# EAGLE board KickerBoard2.0 (EAGLE 9.2.0)
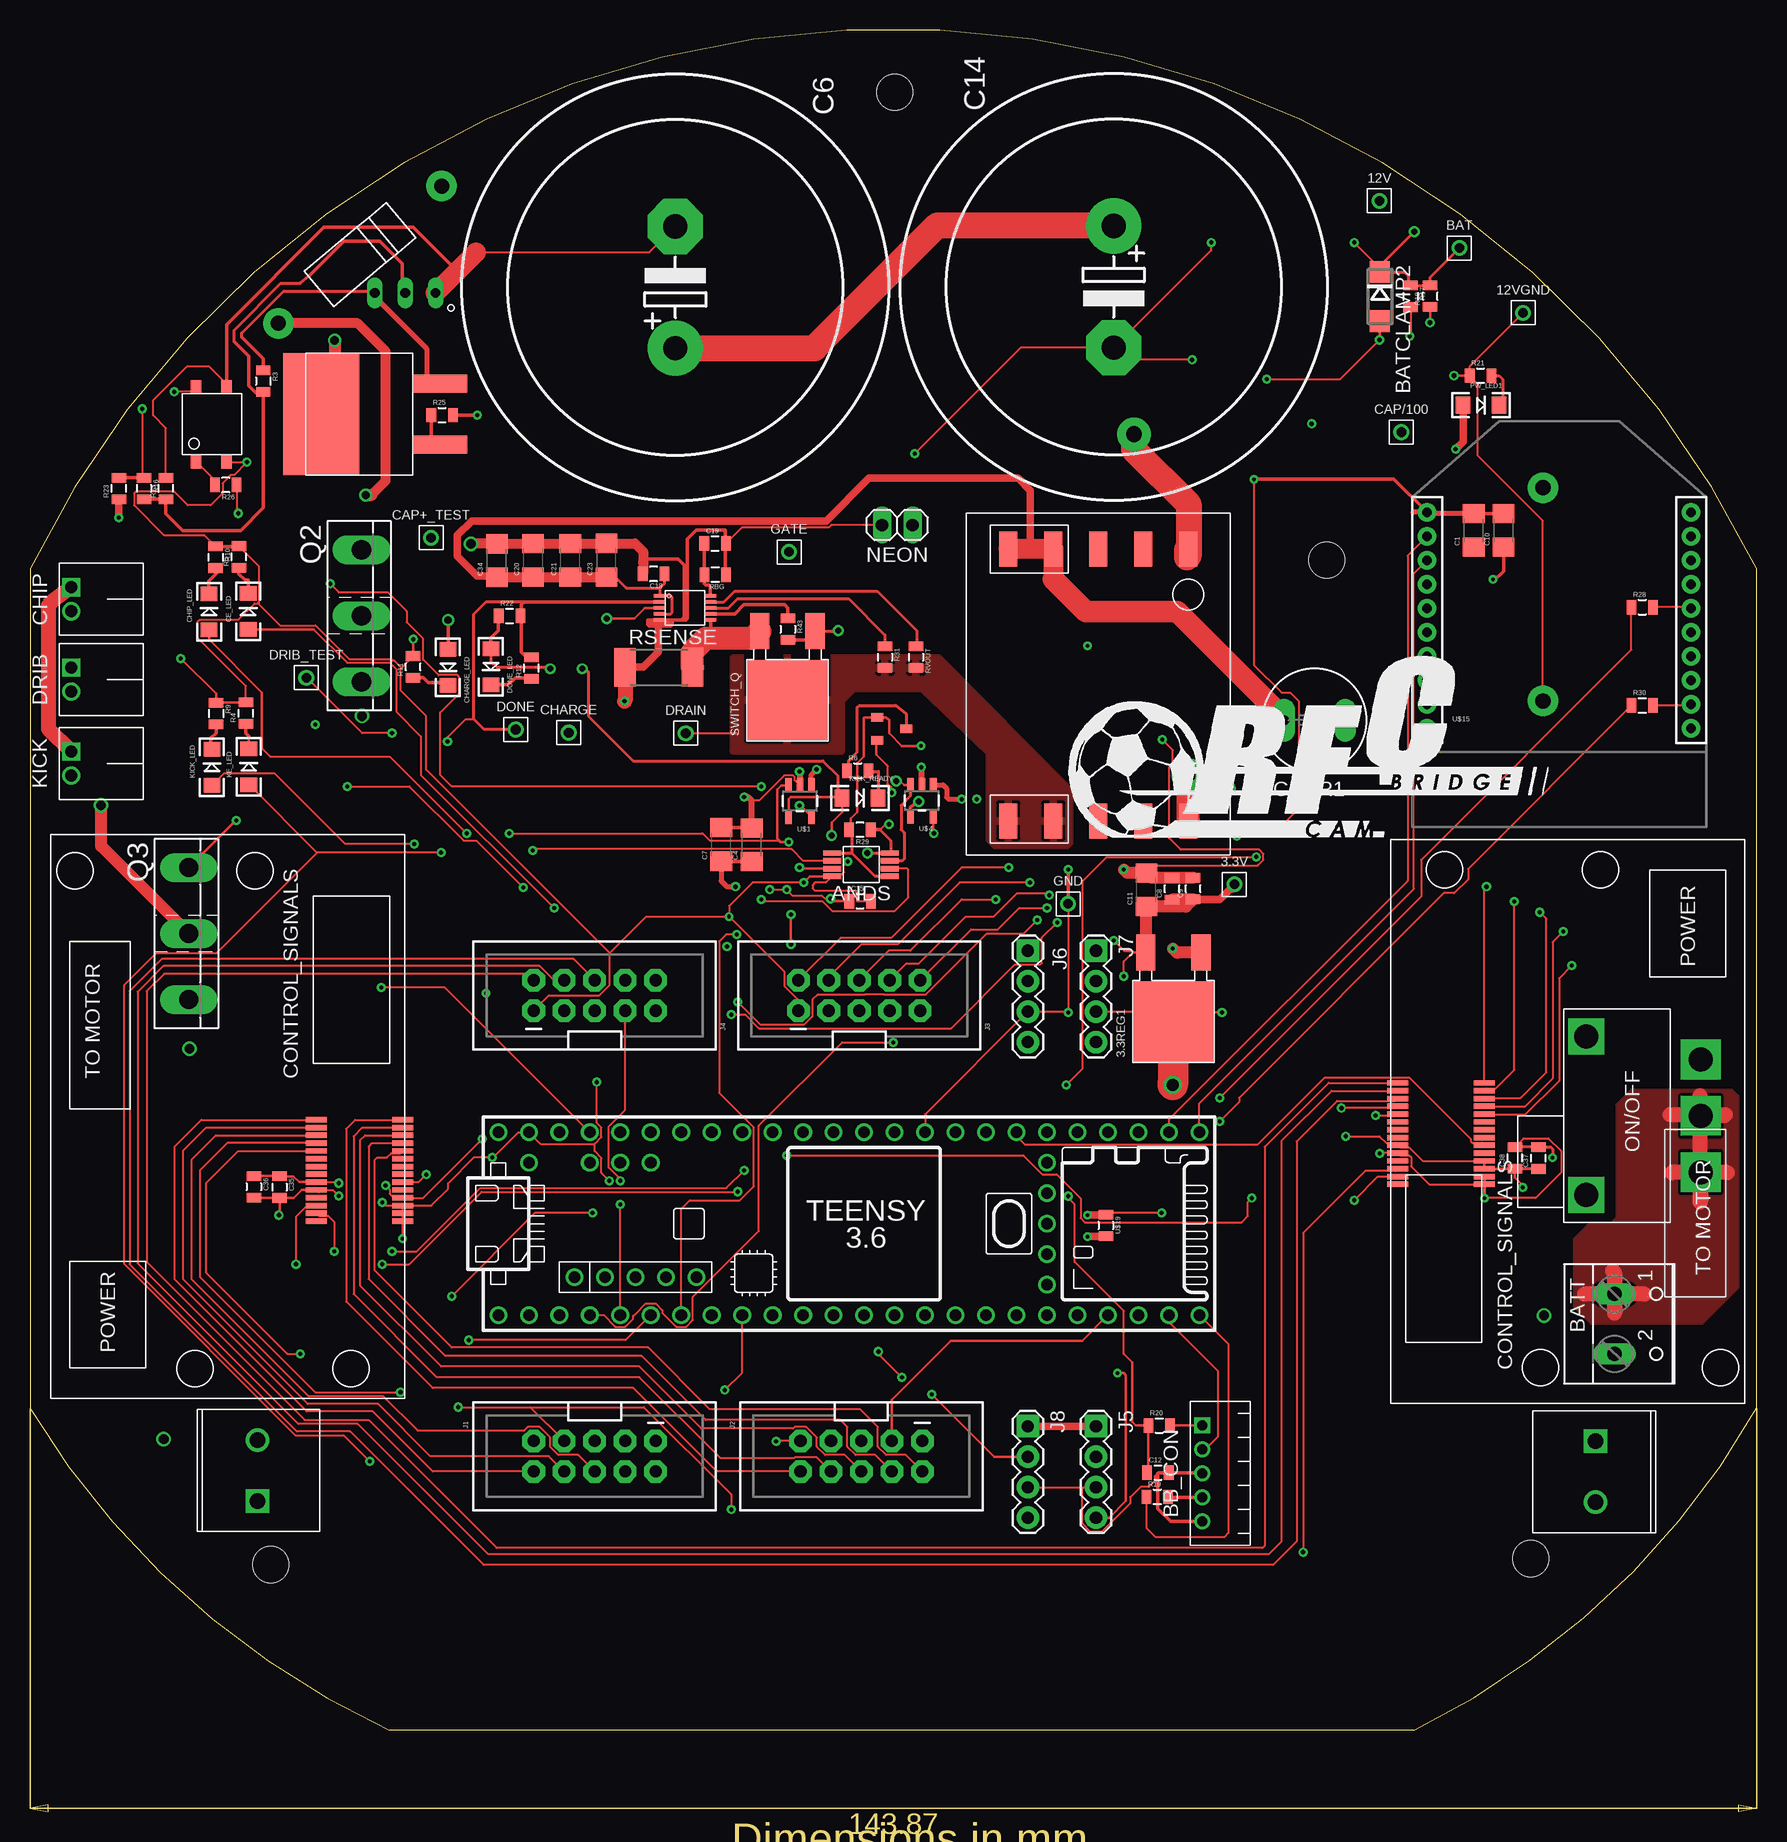
[diagram p2: board, top side]
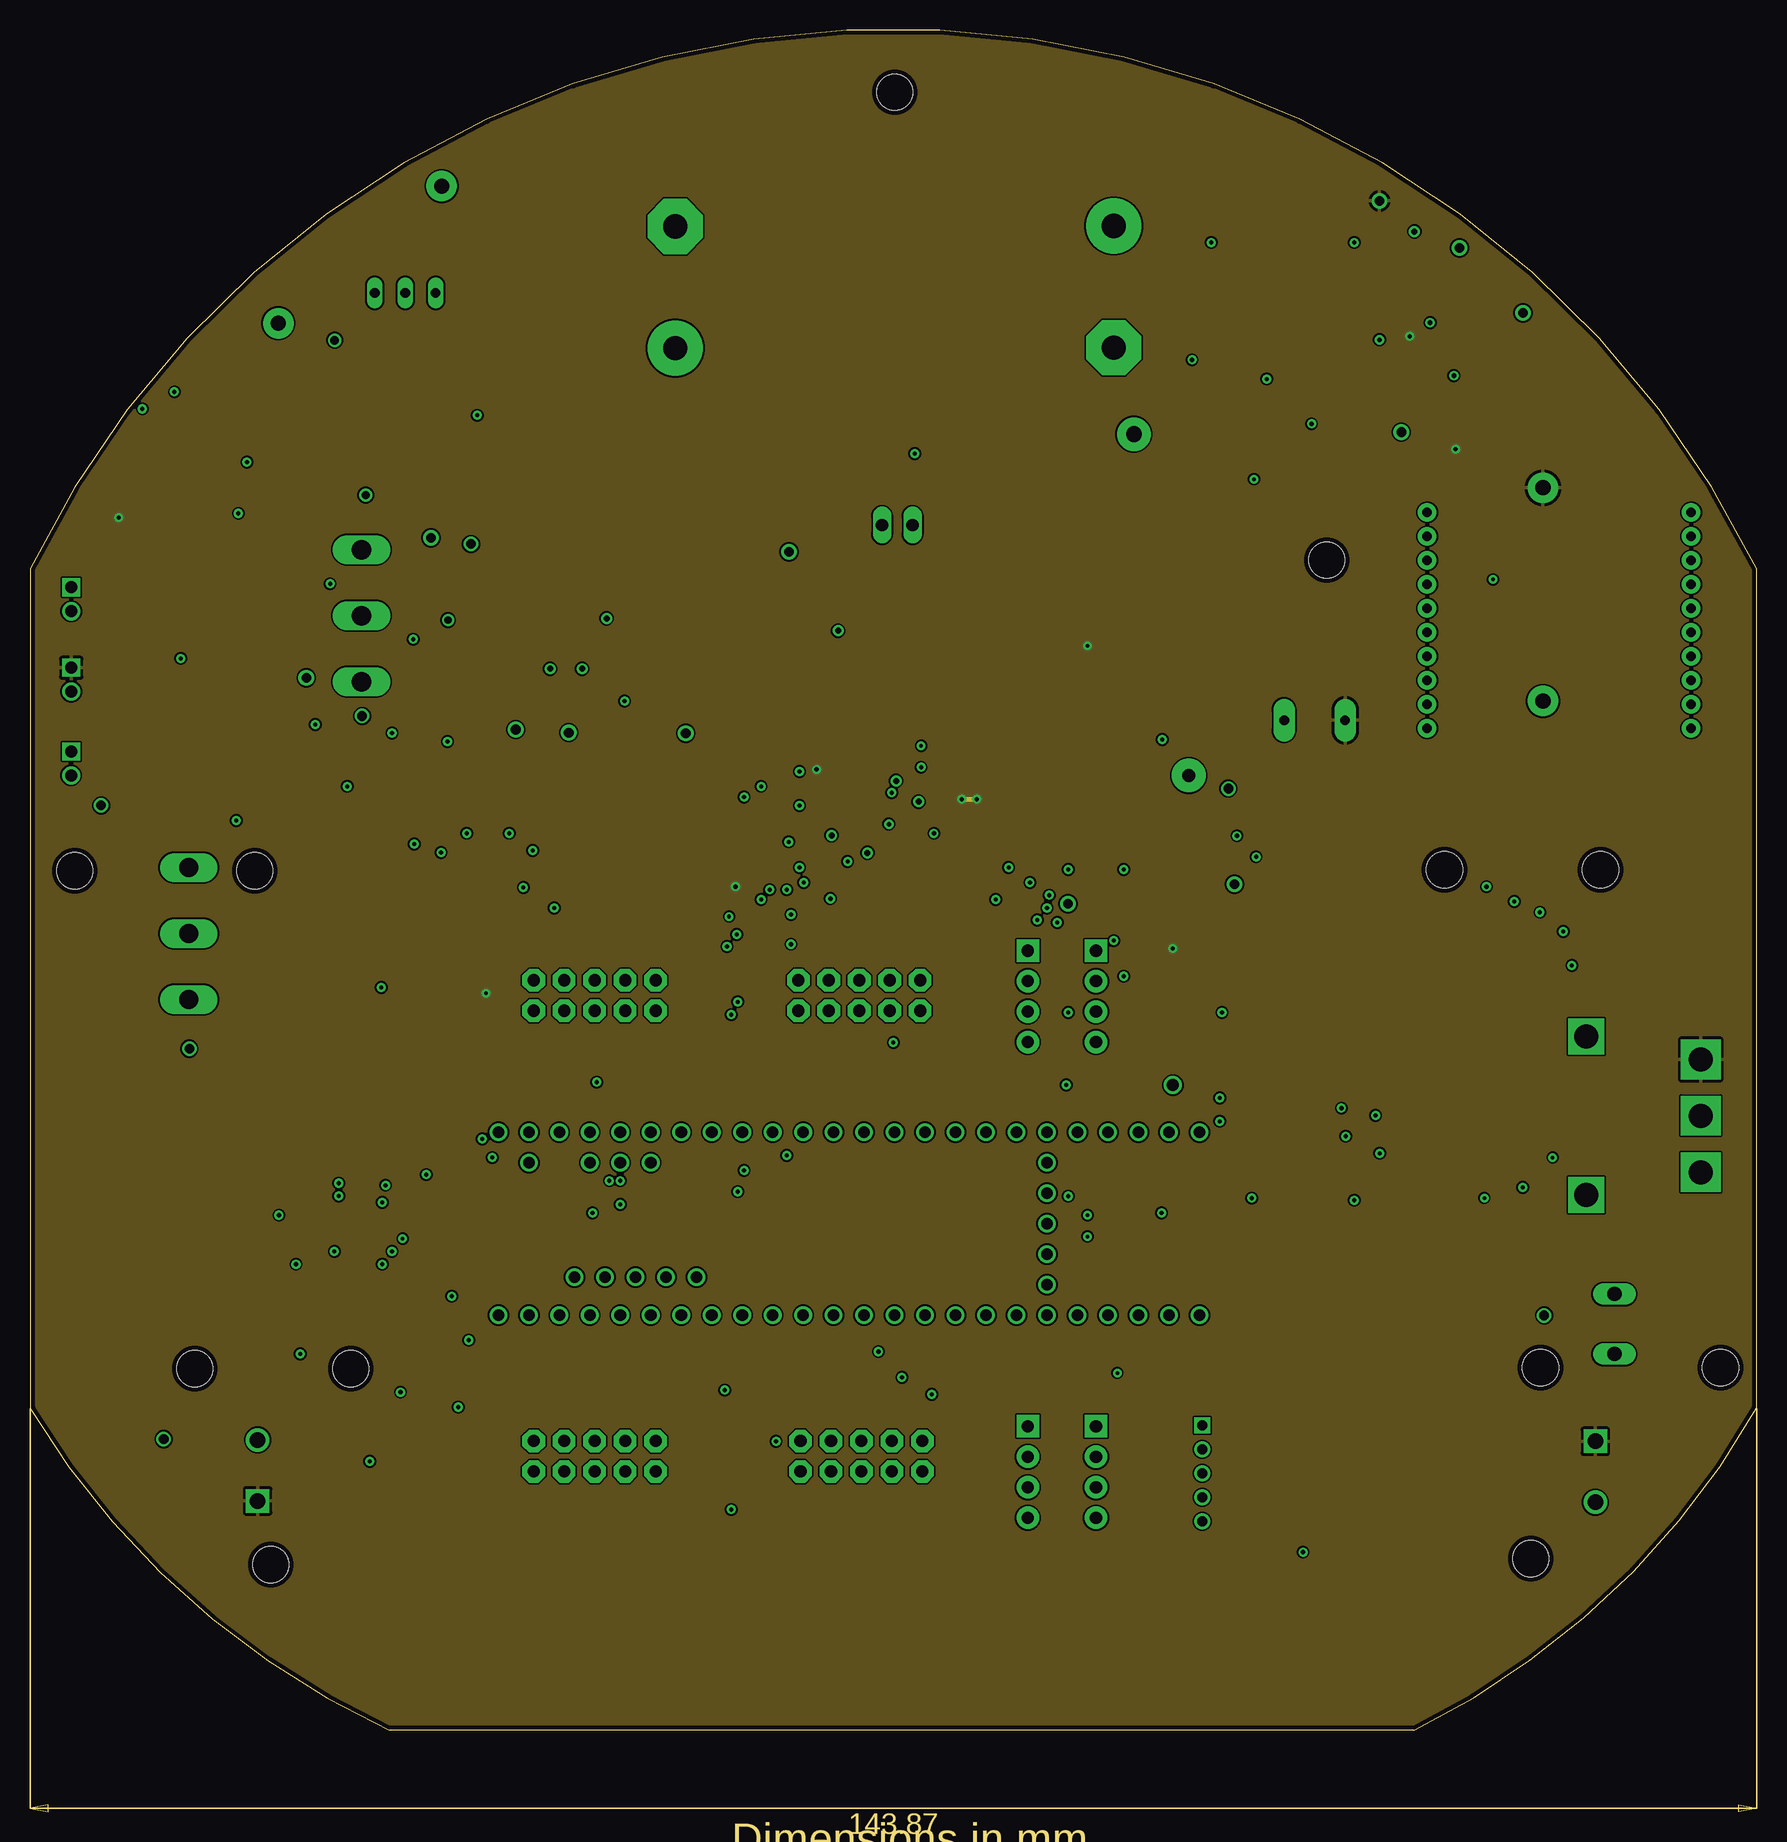
[diagram p3: board, inner layer 12V+]
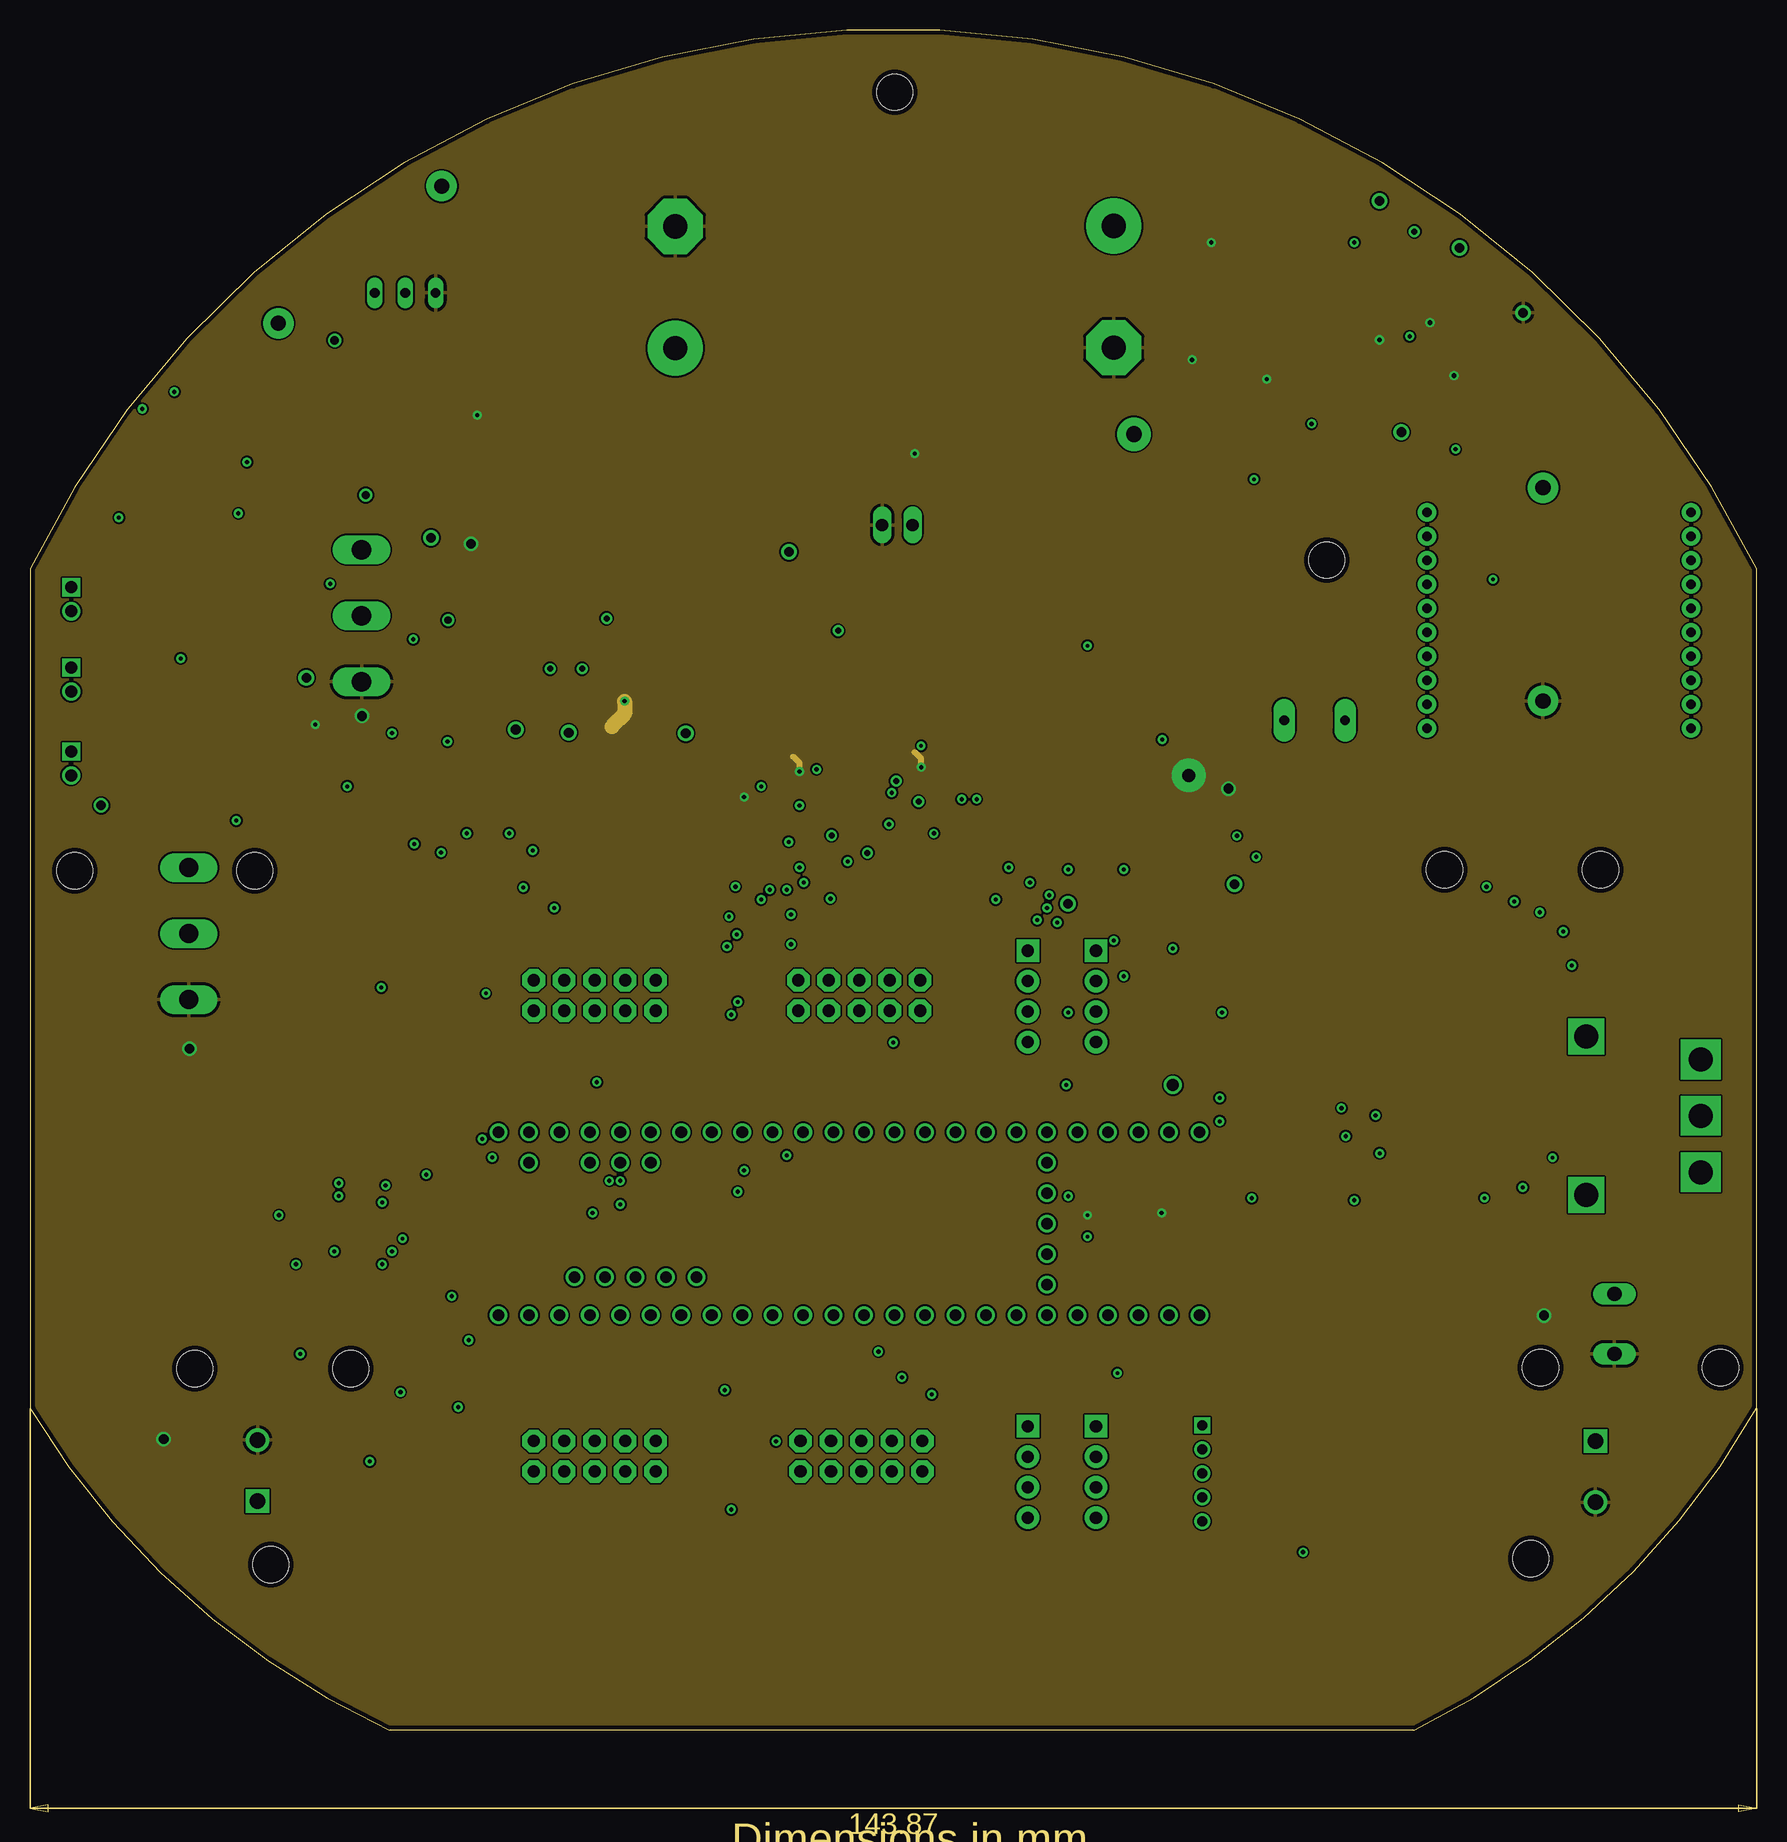
[diagram p4: board, inner layer 12VGND]
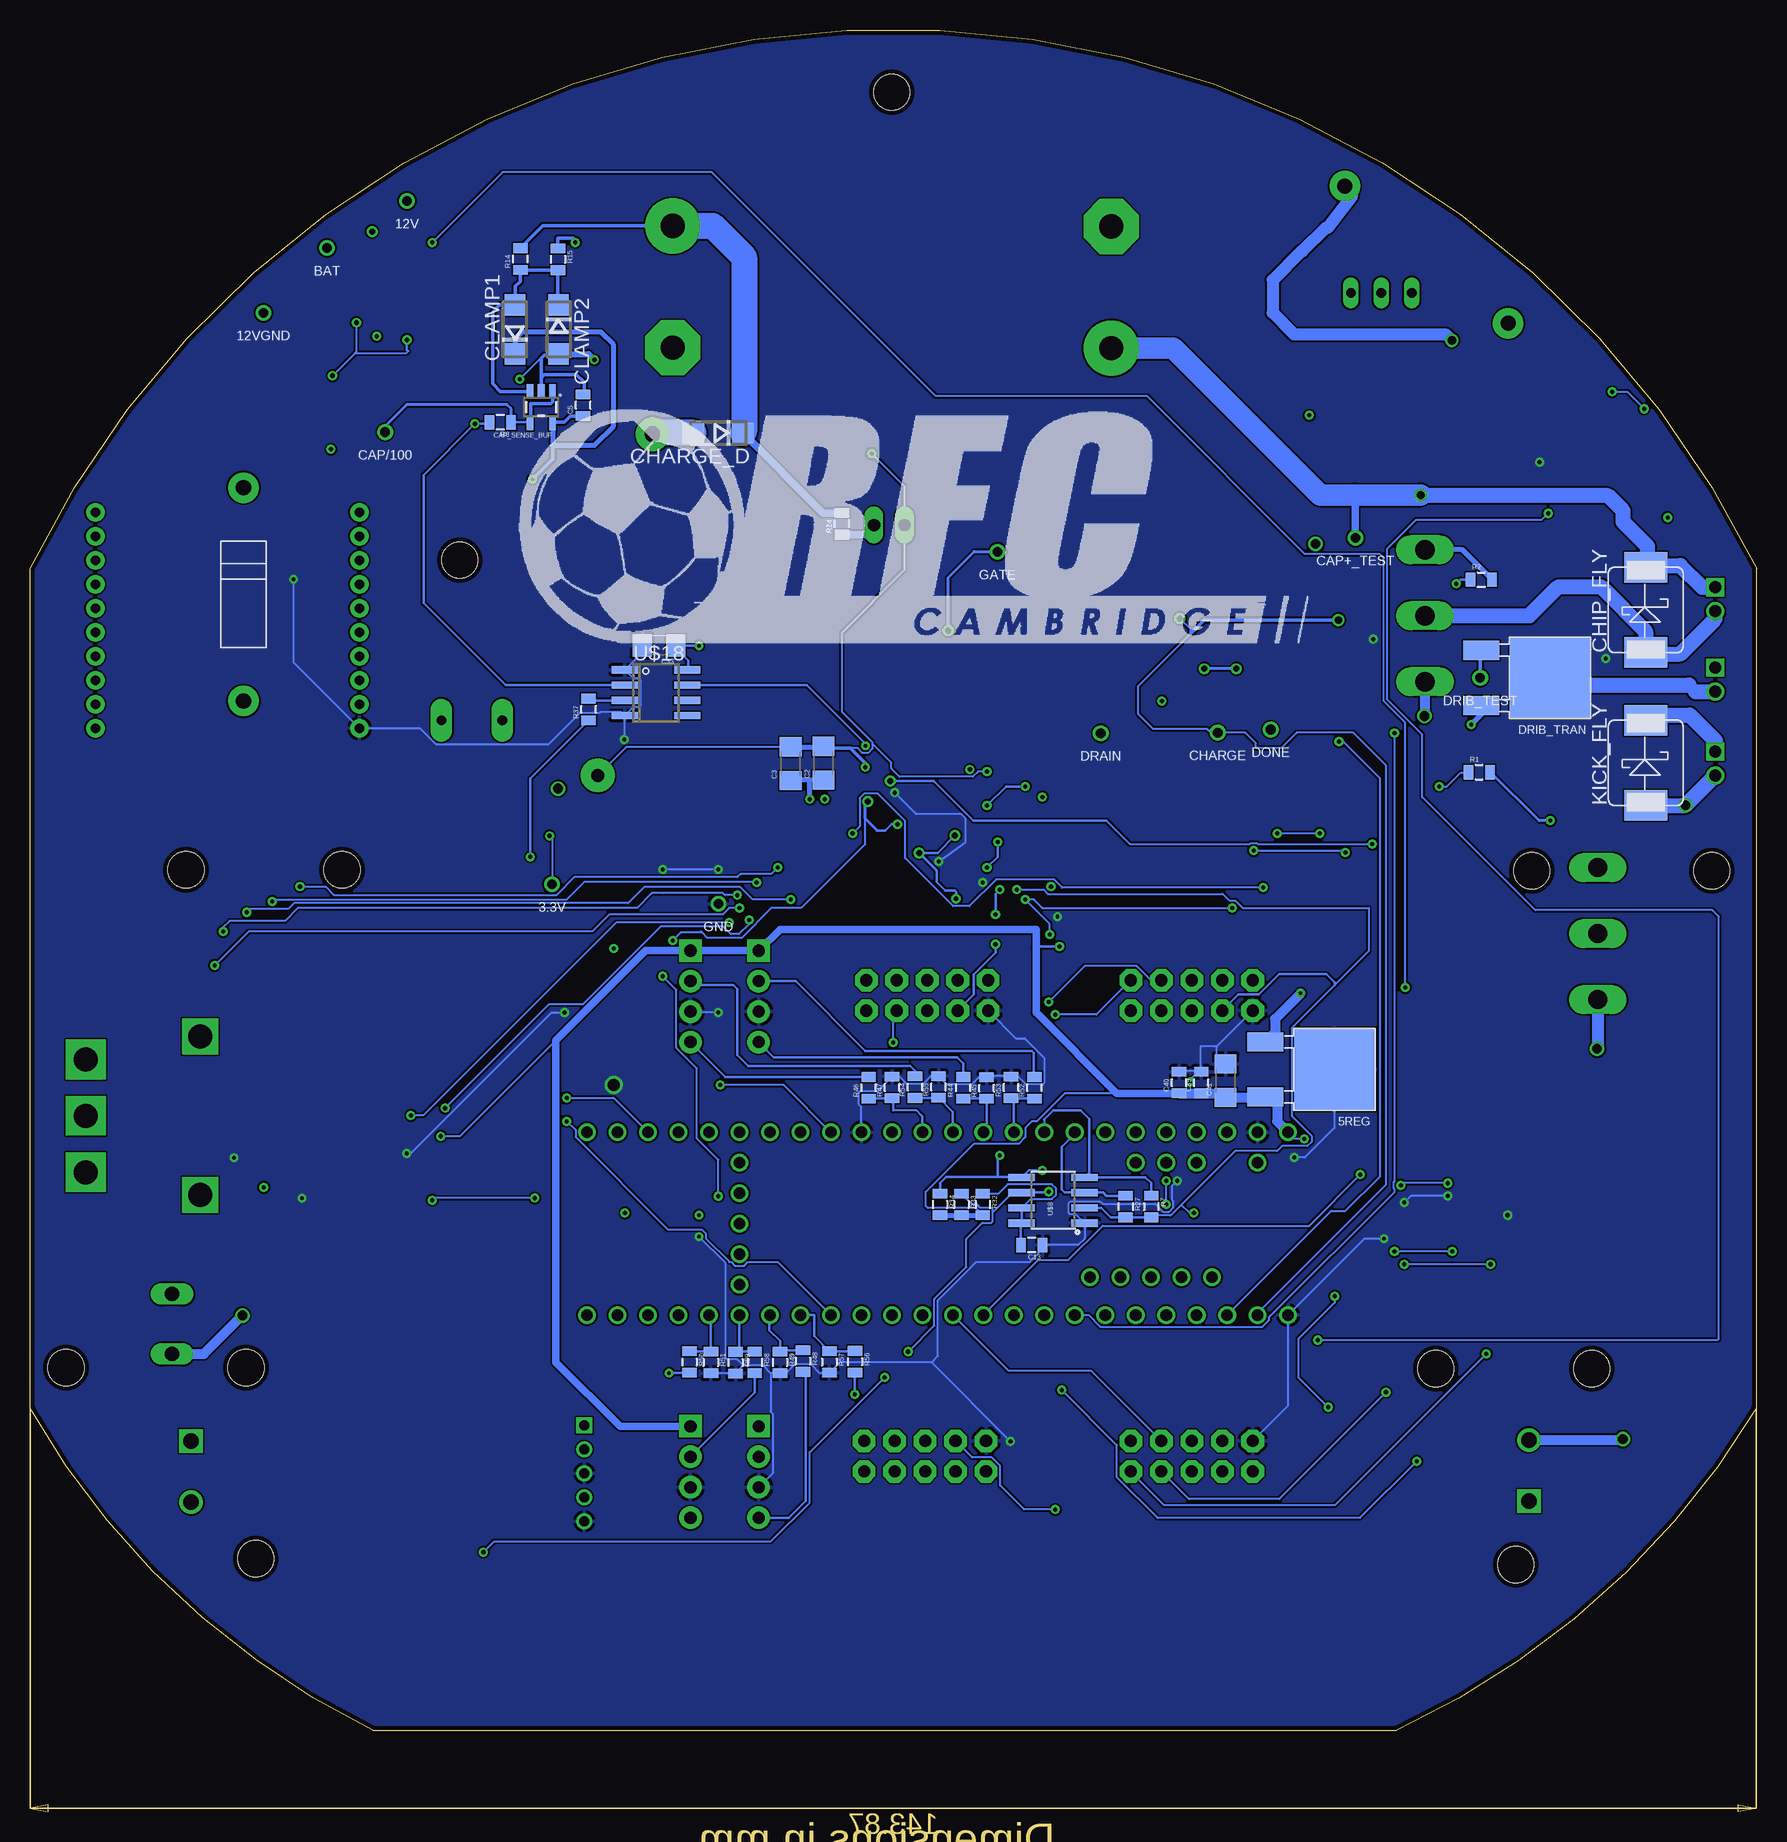
[diagram p5: board, bottom side, seen from below]

Size 143.88 x 141.72 mm. Coordinates in mm from the lower left corner, seen from the top.
Outline: 143.88,26.82 143.88,96.81 arc128 0,96.81 0,26.82 arc34 29.98,0 115.32,0 arc34 143.88,26.82
Copper layers (1*2*3*16): Top(3v3+) 0.035559375mm / dielectric 0.62mm / 12V+ 0.035559375mm / dielectric 0.62mm / 12VGND 0.035559375mm / dielectric 0.62mm / Bottom(3v3GND) 0.035559375mm
Design rules "typical_4pcb *": minimum track width 6mil, minimum drill 8mil, track to track 6mil, track to pad 6mil, pad to pad 6mil, via to via 6mil, smd to smd 6mil, copper to edge 15mil, drill to drill 8mil, minimum pad ring 10mil, minimum via ring 8mil, stop-mask expansion 4mil, vias tented up to drill 0mil, thermal gap 10mil
Holes 3 mm at 125.07,14.3 20.07,13.8 72.07,136.52 108.07,97.52

## Footprints (pad centres in the part's own frame; a part is rotated, then mirrored left to right if it is on the bottom)
DPAK = smd 6.7 x 6.7: DRAIN 0,0 | smd 3 x 1.6: GATE 5.75,-2.3; SOURCE 5.75,2.3
TESTING_PT = drill 0.8: P$1 0,0
TSSOP8 = smd 1.5 x 0.45: P$1 -2.4,0.975; P$2 -2.4,0.325; P$3 -2.4,-0.325; P$4 -2.4,-0.975; P$5 2.4,-0.975; P$6 2.4,-0.325; P$7 2.4,0.325; P$8 2.4,0.975
DO214AC = smd 1.8 x 1.7: A 2.05,0; C -2.05,0
W237-102 = drill 1.194 long: 1 -2.5,-1.27; 2 2.5,-1.27
JST-5-2MM = drill 0.8 square: 1 4,0 | drill 0.8: 2 2,0; 3 0,0; 4 -2,0; 5 -4,0
1206 = smd 1.6 x 1.8: 1 -1.4,0; 2 1.4,0
0805 = smd 0.8 x 1.2: 1 -0.9,0; 2 0.9,0
EB35D = drill 2.007 pad 4.597: + -5.08,0 | drill 2.007 pad 4.597 octagon: - 5.08,0
SOT23-5 = smd 0.55 x 1.2: 1 -0.95,-1.3; 2 0,-1.3; 3 0.95,-1.3; 4 0.95,1.3; 5 -0.95,1.3
LED-1206 = smd 1.2 x 1.4: A -1.5,0; C 1.5,0
10-MSOP = smd 0.97 x 0.31: P$1 -0.485,-0.155; P$2 -0.485,-0.655; P$3 -0.485,-1.155; P$4 -0.485,-1.655; P$5 -0.485,-2.155; P$6 3.785,-2.155; P$7 3.785,-1.655; P$8 3.785,-1.155; P$9 3.785,-0.655; P$10 3.785,-0.155
JST-2-2MM = drill 1 square: 1 1,1 | drill 1: 2 -1,1
DO214AB = smd 2.54 x 3.556: ANODE 0,3.111; CATHODE 7.112,3.111
2X5-SHROUDED = drill 1.016 pad 1.88 octagon: 1 -1.27,5.08; 2 1.27,5.08; 3 -1.27,2.54; 4 1.27,2.54; 5 -1.27,0; 6 1.27,0; 7 -1.27,-2.54; 8 1.27,-2.54; 9 -1.27,-5.08; 10 1.27,-5.08
1X04 = drill 1.016 pad 1.88 square: 1 0,0 | drill 1.016 pad 1.88: 2 2.54,0; 3 5.08,0; 4 7.62,0
TR5 = drill 0.813 pad 1.778 long: 1 -2.54,0; 2 2.54,0
1X02 = drill 1.016 long: 1 -1.27,0; 2 1.27,0
CK_SWITCH = drill 2 pad 3.302 square: COM 0,0; IN1 4.699,0; IN2 -4.699,0 | drill 2 pad 2.54 square: SUP1 -6.604,-9.525; SUP2 6.604,-9.525
TO-247AD-V = drill 1.6 long: D 0,-2.54; G -5.5,-2.54; S 5.5,-2.54
R2512 = smd 1.8 x 3.2: 1 -2.8,0; 2 2.8,0
TO-263 = smd 1.524 x 4.572: LOWER_LEFT 2.54,-2.286; LOWER_RIGHT 7.62,-2.286 | smd 10.16 x 6.35: TAB 5.08,7.62
10-TRANSFORMER = smd 2.92 x 1.52: P$1 0,0; P$2 0,-3.75; P$3 0,-7.5; P$4 0,-11.25; P$5 0,-15; P$6 22.67,-15; P$7 22.67,-11.25; P$8 22.67,-7.5; P$9 22.67,-3.75; P$10 22.67,0
SOP4 = smd 0.889 x 1.143: 1 0.813,-0.584; 2 3.353,-0.584; 3 3.353,5.664; 4 0.813,5.639
TO92 = drill 0.8 long: CENTER 2.54,0; LEFT 0,0; RIGHT 5.08,0
THROUGH-HOLE-2 = drill 1.27 pad 2.54: + 0,0; - 17.78,0
SOIC8 = smd 0.61 x 2.21: 1 -1.905,-2.616; 2 -0.635,-2.616; 3 0.635,-2.616; 4 1.905,-2.616; 5 1.905,2.616; 6 0.635,2.616; 7 -0.635,2.616; 8 -1.905,2.616
MOTOR_BOARD = hole 3: 2.5,17.5; 2.5,4.5; 44,27.5; 44,12.5
1X02-PHEONIX = drill 1.3 square: 1 0,0 | drill 1.3: 2 5.08,0
TEENSY_3.5/3.6 = drill 0.965: 0/RX -25.4,-7.62; 1/TX -22.86,-7.62; 2 -20.32,-7.62; 3/CANTX -17.78,-7.62; 3V3 7.62,-7.62; 3V3_2 17.78,-2.54; 3V3_LO -22.86,7.62; 4/CANRX -15.24,-7.62; 5 -12.7,-7.62; 6 -10.16,-7.62; 7 -7.62,-7.62; 8 -5.08,-7.62; 9/CS -2.54,-7.62; 10/CS 0,-7.62; 11/MOSI 2.54,-7.62; 12/MISO 5.08,-7.62; 13/SCK 5.08,7.62; 14/A0 2.54,7.62; 15/A1 0,7.62; 16/A2 -2.54,7.62; 17/A3 -5.08,7.62; 18/A4/SDA -7.62,7.62; 19/A5/SCL -10.16,7.62; 20/A6 -12.7,7.62; 21/A7 -15.24,7.62; 21/DAC0 12.7,7.62; 22/A8 -17.78,7.62; 23/A9 -20.32,7.62; 24 10.16,-7.62; 25 12.7,-7.62; 26 15.24,-7.62; 27 17.78,-7.62; 28 20.32,-7.62; 29 22.86,-7.62; 30 25.4,-7.62; 31/A12 27.94,-7.62; 32/A13 30.48,-7.62; 33/A14 30.48,7.62; 34/A15 27.94,7.62; 35/A16 25.4,7.62; 36/A17 22.86,7.62; 37/A18 20.32,7.62; 38/A19 17.78,7.62; 39/A20 15.24,7.62; A10 -17.78,5.08; A11 -15.24,5.08; A22/DAC1 10.16,7.62; AGND -25.4,7.62; AREF -20.32,5.08; GND -27.94,-7.62; GND2 7.62,7.62; GND3 17.78,0; PROG 17.78,2.54; RESET 17.78,5.08; U5V -21.59,-4.445; UD+ -16.51,-4.445; UD- -19.05,-4.445; UGND1 -13.97,-4.445; UGND2 -11.43,-4.445; VBAT 17.78,-5.08; VIN -27.94,7.62; VUSB -25.4,5.08
XBEE-1 = drill 0.8 pad 1.524: 1 -11,20; 2 -11,18; 3 -11,16; 4 -11,14; 5 -11,12; 6 -11,10; 7 -11,8; 8 -11,6; 9 -11,4; 10 -11,2; 11 11,2; 12 11,4; 13 11,6; 14 11,8; 15 11,10; 16 11,12; 17 11,14; 18 11,16; 19 11,18; 20 11,20
MULTIPOWERSO-30 = smd 0.508 x 12: 1 -7,-4; 15 7,-4; 16 7,4; 30 -7,4 | smd 0.508 x 2: 2 -6,-9; 4 -4,-9; 5 -3,-9; 6 -2,-9; 7 -1,-9; 8 0,-9; 9 1,-9; 10 2,-9; 11 3,-9; 12 4,-9; 14 6,-9; 17 6,9; 18 5,9; 19 4,9; 20 3,9; 22 1,9; 24 -1,9; 26 -3,9; 27 -4,9; 28 -5,9; 29 -6,9 | smd 0.508 x 4: 3 -5,-8; 13 5,-8; 21 2,8; 23 0,8; 25 -2,8 | smd 6.5 x 6: OUTA -4.25,3.5; OUTB 4.25,3.5 | smd 1 x 7.5: OUTA@1 -7,-2.755; OUTB@1 7,-2.755 | smd 11 x 6: VCC 0,-3.5 | smd 0.65 x 8.3: VCC@1 0,3.145
SSOP = smd 0.45 x 1.75: 1 0,0; 2 0.65,0; 3 1.3,0; 4 1.95,0; 5 2.6,0; 6 3.25,0; 7 3.9,0; 8 4.55,0; 9 5.2,0; 10 5.85,0; 11 6.5,0; 12 7.15,0; 13 7.8,0; 14 8.45,0; 15 8.45,7.2; 16 7.8,7.2; 17 7.15,7.2; 18 6.5,7.2; 19 5.85,7.2; 20 5.2,7.2; 21 4.55,7.2; 22 3.9,7.2; 23 3.25,7.2; 24 2.6,7.2; 25 1.95,7.2; 26 1.3,7.2; 27 0.65,7.2; 28 0,7.2
SOIC8' = smd 0.6 x 2.2: 1 -1.905,-2.6; 2 -0.635,-2.6; 3 0.635,-2.6; 4 1.905,-2.6; 5 1.905,2.6; 6 0.635,2.6; 7 -0.635,2.6; 8 -1.905,2.6
TO252-3 = smd 1 x 1.6: 1 -2.28,-6.07; 2 2.28,-6.07 | smd 5.4 x 6.2: 3 0,1.23
SOT-23 = smd 1 x 0.7: D 0,0; G -2.4,0.95; S -2.4,-0.95

## Placement (x,y rotation side)
3.3REG1  3.3REG1AREG  [DPAK]  95.28,59.07 90 top
3.3V  TEST_PT  [TESTING_PT]  100.37,70.51 0 top
5REG  3.3REG1AREG  [DPAK]  35.17,55.07 180 bottom
12V  TEST_PT  [TESTING_PT]  112.46,127.47 0 top
12VGND  TEST_PT  [TESTING_PT]  124.43,118.15 0 top
ANDS  AND-DUAL  [TSSOP8]  69.25,72.14 0 top
BAT  TEST_PT  [TESTING_PT]  119.12,123.54 0 top
BATCLAMP2  DIODE-ZENERDO214AC  [DO214AC]  112.48,119.5 270 top
BATT  [W237-102]  133.31,33.86 270 top
BB_CON  JST-5  [JST-5-2MM]  97.69,21.41 90 top
C1  1uF  [1206]  120.31,100 90 top
C2  .1uF  [1206]  77.74,80.61 90 bottom
C3  10uF  [1206]  80.48,80.56 90 bottom
C4  .1uF  [1206]  60.15,73.81 90 top
C5  .1uF  [0805]  97.78,110.45 90 bottom
C6  1500uF  [EB35D]  53.78,120.27 90 top
C7  10uF  [1206]  57.6,73.83 90 top
C8  1uF  [0805]  95.17,70.14 90 top
C9  .01uF  [0805]  96.93,70.15 90 top
C10  .01uF  [1206]  122.8,100 90 top
C11  47uF  [1206]  93.03,70.05 90 top
C12  4.7uF  [0805]  94,21.47 0 top
C13  100nF  [0805]  60.39,40.44 180 bottom
C14  1500uF  [EB35D]  90.31,120.31 270 top
C15  .1uF  [0805]  69.17,69.1 0 top
C18  10uF  [0805]  51.96,96.38 180 top
C19  100pF  [0805]  57.09,98.92 0 top
C20  47uF  [1206]  41.93,97.51 90 top
C21  47uF  [1206]  45.02,97.52 90 top
C23  47uF  [1206]  48.04,97.52 90 top
C33  1uF  [1206]  91.47,90.41 180 bottom
C34  47uF  [1206]  38.9,97.49 90 top
C35  100nF  [0805]  20.79,45.27 270 top
C36  2.2uF  [0805]  18.66,45.29 270 top
C37  100nF  [0805]  125.7,47.68 90 top
C38  2.2uF  [0805]  123.74,47.7 90 top
C39  1uF  [0805]  46.27,53.98 90 bottom
C40  .01uF  [0805]  48.12,53.98 90 bottom
C41  47uF  [1206]  44.24,54.13 90 bottom
CAP+_TEST  TEST_PT  [TESTING_PT]  33.42,99.39 0 top
CAP/100  TEST_PT  [TESTING_PT]  114.28,108.2 0 top
CAP_SENSE_BUF  MCP6291T-E/OT  [SOT23-5]  101.27,110.28 180 bottom
CE_LED  [LED-1206]  18.18,93.25 90 top
CHARGE  TEST_PT  [TESTING_PT]  44.9,83.15 0 top
CHARGE_D  1kV, ultrafast  [DO214AC]  86.52,108.14 180 bottom
CHARGE_LED  [LED-1206]  34.83,88.6 270 top
CHARGE_U  LT3750  [10-MSOP]  52.93,94.7 0 top
CHIP  JST-22MM  [JST-2-2MM]  4.44,94.26 90 top
CHIP_FLY  DIODE-ZENERDO214AB  [DO214AB]  6.12,89.83 90 bottom
CHIP_LED  [LED-1206]  14.92,93.23 90 top
CLAMP1  DIODE-ZENERDO214AC  [DO214AC]  103.45,116.75 90 bottom
CLAMP2  DIODE-ZENERDO214AC  [DO214AC]  99.84,116.76 270 bottom
DONE  TEST_PT  [TESTING_PT]  40.48,83.41 0 top
DONE_LED  [LED-1206]  38.41,88.65 270 top
DRAIN  TEST_PT  [TESTING_PT]  54.65,83.11 0 top
DRIB  JST-22MM  [JST-2-2MM]  4.44,87.56 90 top
DRIB_TEST  TEST_PT  [TESTING_PT]  23.03,87.73 0 top
DRIB_TRAN  [DPAK]  17.19,87.72 180 bottom
GATE  TEST_PT  [TESTING_PT]  63.25,98.21 0 top
GND  TEST_PT  [TESTING_PT]  86.51,68.89 0 top
J1  [2X5-SHROUDED]  47.06,22.84 270 top
J2  [2X5-SHROUDED]  69.28,22.84 270 top
J3  [2X5-SHROUDED]  69.1,61.24 90 top
J4  [2X5-SHROUDED]  47.06,61.24 90 top
J5  [1X04]  88.84,25.33 270 top
J6  [1X04]  83.15,64.98 270 top
J7  [1X04]  88.84,64.98 270 top
J8  [1X04]  83.15,25.33 270 top
KE_LED  [LED-1206]  18.23,80.31 90 top
KICK  JST-22MM  [JST-2-2MM]  4.42,80.59 90 top
KICK_FLY  DIODE-ZENERDO214AB  [DO214AB]  6.12,77.08 90 bottom
KICK_LED  [LED-1206]  15.16,80.27 90 top
KICK_READY  [LED-1206]  69.18,77.69 0 top
KICKER1  [TR5]  107.05,84.19 180 top
NEON  [1X02]  72.28,100.46 180 top
ON/OFF  SPDT-SWITCH  [CK_SWITCH]  139.23,51.21 270 top
PW_LED1  [LED-1206]  120.91,110.45 0 top
Q2  IXFH6N90  [TO-247AD-V]  30.17,92.89 270 top
Q3  IXFH6N90  [TO-247AD-V]  15.76,66.4 270 top
R1  100  [0805]  23.11,79.86 0 bottom
R2  100  [0805]  22.93,95.91 0 bottom
R3  250k  [0805]  19.44,112.45 270 top
R4  1k  [0805]  17.99,84.77 90 top
R5  1k  [0805]  17.41,97.8 90 top
R6  1k  [0805]  68.99,79.98 0 top
R7  4.7k  [0805]  50.44,43.64 270 bottom
R8  1k  [0805]  104.69,109.02 180 bottom
R9  1k  [0805]  15.51,84.74 270 top
R10  1k  [0805]  15.46,97.77 270 top
R11  1k  [0805]  31.92,88.63 90 top
R12  1k  [0805]  41.79,88.54 90 top
R13  2.5k  [0805]  11.33,103.5 90 top
R14  1M  [0805]  103.01,122.64 90 bottom
R15  10K  [0805]  99.88,122.6 270 bottom
R16  1k  [0805]  9.5,103.5 270 top
R17  80k  [0805]  115.05,119.52 270 top
R18  20k  [0805]  116.68,119.54 90 top
R19  20  [0805]  93.94,19.45 0 top
R20  100  [0805]  94.1,25.39 0 top
R21  1k  [0805]  120.88,112.9 0 top
R22  100k  [0805]  39.97,92.88 0 top
R23  1.5k  [0805]  7.4,103.5 90 top
R24  536k  [0805]  76.22,100.56 90 bottom
R25  200  [0805]  34.34,109.61 0 top
R26  300  [0805]  16.32,103.79 180 top
R27  4.7k  [0805]  52.57,43.64 270 bottom
R28  0  [0805]  134.36,93.6 0 top
R29  1M  [0805]  69.16,75.05 180 top
R30  0  [0805]  134.36,85.42 0 top
R31  43k  [0805]  71.25,89.44 270 top
R32  200k  [0805]  64.48,43.82 270 bottom
R33  4.7k  [0805]  66.26,43.82 270 bottom
R34  4.7k  [0805]  68.04,43.82 270 bottom
R37  100k  [0805]  97.32,85.09 90 bottom
R43  100  [0805]  63.16,91.77 270 top
R44  39k  [0805]  66.11,53.55 90 bottom
R45  75k  [0805]  64.15,53.52 90 bottom
R46  39k  [0805]  73.98,53.55 90 bottom
R47  75k  [0805]  72.03,53.57 90 bottom
R48  39k  [0805]  79.47,30.76 270 bottom
R49  75k  [0805]  81.37,30.66 270 bottom
R50  39k  [0805]  88.92,30.69 270 bottom
R51  75k  [0805]  87.14,30.66 270 bottom
R52  39k  [0805]  60.16,53.55 90 bottom
R53  75k  [0805]  62.12,53.57 90 bottom
R54  39k  [0805]  70.12,53.6 90 bottom
R55  75k  [0805]  68.16,53.62 90 bottom
R56  39k  [0805]  75.12,30.71 270 bottom
R57  75k  [0805]  77.26,30.69 270 bottom
R58  39k  [0805]  83.48,30.66 270 bottom
R59  75k  [0805]  85.08,30.64 270 bottom
RBG  2.49k  [0805]  57.1,96.31 180 top
RSENSE  10m  [R2512]  52.39,88.59 0 top
RVOUT  50.4k  [0805]  73.83,89.44 270 top
SWITCH_Q  [DPAK]  63.12,85.86 90 top
U$1  FAN31111  [SOT23-5]  64.17,77.45 180 top
U$2  IXTA3N50D2  [TO-263]  31.88,104.62 90 top
U$3  32052-TRANSFORMER  [10-TRANSFORMER]  96.53,98.46 270 top
U$4  FAN31111  [SOT23-5]  74.32,77.49 180 top
U$5  VO1400AEFTR  [SOP4]  13.03,106.31 0 top
U$6  ZTX718  [TO92]  33.81,119.81 180 top
U$7  1N4007  [THROUGH-HOLE-2]  20.69,117.28 40 top
U$8  PCA9306  [SOIC8]  58.61,44.17 90 bottom
U$9  MOTOR_BOARD  [MOTOR_BOARD]  31.23,27.64 90 top
U$10  MOTOR_BOARD  [MOTOR_BOARD]  113.38,74.22 270 top
U$11  PHEONIX-SCREW-TERM  [1X02-PHEONIX]  130.45,24.08 270 top
U$12  13VZENER  [THROUGH-HOLE-2]  126.08,85.79 90 bottom
U$13  PHEONIX-SCREW-TERM  [1X02-PHEONIX]  18.96,19.1 90 top
U$14  TEENSY_3.5/3.6  [TEENSY_3.5/3.6]  66.97,42.22 0 top
U$15  XBEE-1B1  [XBEE-1]  127.42,81.51 0 top
U$16  VNH5019  [MULTIPOWERSO-30]  -5.93,-35.3 0 top  (outside the outline)
U$17  IO-EXPANDER  [SSOP]  23.87,50.88 270 top
U$18  LM311  [SOIC8']  91.71,86.48 270 bottom
U$19  INDUCTOR  [0805]  89.65,42.07 270 top
U$20  MOSFET-NCH  [TO252-3]  -22.46,-37.97 0 top  (outside the outline)
U$21  IO-EXPANDER  [SSOP]  113.99,53.95 270 top
U$22  N-FET  [SOT-23]  73.02,83.47 0 top

## Tracks (layer width: path | path; a pad name or v marks a point on that pad's centre or on a via)
3.3V  (via drill 0.3, 0.35, 0.38, 0.5)
  Top(3v3+) 0.152: v91.15,62.84 91.15,64.09 | 91.89,64.82 91.89,64.95 91.17,64.95 v90.31,65.81 | v102,104.27 102,88.8 104.31,86.49 105.02,86.49 105.73,85.78 105.73,76.83 103.45,74.55 v100.58,74.55 | 91.15,31.37 91.15,34.93 87.06,39.02 87.06,43.82 86.51,44.37 v86.51,44.51 | C15.1 66.46,69.1 66.01,69.55 63.57,69.55 v63.06,70.06 v61.64,70.06 | v46.88,43.11 42.08,43.11 v35.14,36.17 | v35.68,26.93 41.7,26.93 | 41.7,26.93 J1.7 | 41.7,26.93 51.15,26.93 58.44,19.64 v58.44,18.39
  Top(3v3+) 0.203: U$1.4 63.22,76.89 63.24,76.91 63.24,77.6 63.41,77.78 67.59,77.78 KICK_READY.A | C12.1 93.2,21.57 R20.1 92.16,25.39 91.86,25.68 91.86,30.66 91.15,31.37 | C15.1 66.91,69.1 v66.69,69.32 | 70.12,75.11 70.91,75.11 71.31,75.52 v71.57,75.52 | 67.33,77.69 KICK_READY.A | KICK_READY.A 67.68,76.53 66.79,75.64 v66.79,74.58 | 3.3REG1.SOURCE 91.89,64.82 91.15,64.09 | v63.41,65.51 v63.41,68
  Top(3v3+) 0.254: v69.79,73.13 71.64,73.13 ANDS.P$8 71.72,73.19 71.72,74.15 70.81,75.05 R29.1 70.12,75.11 | U$4.4 73.37,76.97 v74.06,77.4 | DONE_LED.A 38.41,89.09 38.9,88.6 43.22,88.6 v43.35,88.47 | v46.02,88.47 46.27,88.47 46.52,88.22 46.52,84.53 50.26,80.8 66.08,80.8 67.33,79.56 67.33,77.69
  Top(3v3+) 0.305: DONE_LED.A 38.41,91.03 39.03,91.65 39.03,92.85 R22.1 | v102,104.27 113.66,104.27 U$15.1 | C10.2 C1.2
  Top(3v3+) 0.406: C1.2 116.53,101.4 U$15.1 115.24,101.51
  Top(3v3+) 0.61: C9.1 99.15,69.25 100.04,70.14 100.23,70.11 3.3V.P$1
  Top(3v3+) 1.016: 3.3REG1.SOURCE 92.98,68.59 C11.1 96.33,68.65 C9.1 C8.1
  Bottom(3v3GND) 0.152: 74.31,76.03 74.31,73.82 79.59,68.53 82.08,68.53 84.57,66.04 87.42,66.04 87.86,66.49 | 87.95,66.58 87.86,66.49 | v100.58,74.55 100.36,74.34 3.3V.P$1 | 87.86,66.49 89.64,66.49 v90.31,65.81 | v86.51,44.51 86.51,47.54 88.31,49.33 88.31,55.17 90.01,56.87 90.01,61.7 v91.15,62.84 | v61.64,70.06 59.4,70.06 59.04,69.7 44.49,69.7 43.93,69.14 43.43,69.14 42.82,68.53 32.3,68.53 32.3,64.96 35.14,62.13 38.75,58.52 38.75,51.22 37.07,49.54 37.07,49.04 37.43,48.68 39.53,48.68 39.95,48.26 43.46,48.26 47.92,43.8 | R7.2 50.27,42.91 48.81,42.91 47.92,43.8 | 47.92,43.8 47.23,43.11 v46.88,43.11 | v35.14,36.17 35.14,35.64 38.17,32.62 38.17,29.42 v35.68,26.93 | v58.44,18.39 61.03,18.39 63.03,20.4 63.03,22.05 63.72,22.74 65.37,22.74 J2.7
  Bottom(3v3GND) 0.2: R27.2 R7.2
  Bottom(3v3GND) 0.203: v66.69,69.32 66.69,69.88 66.79,69.98 67.61,69.98 68.32,70.69 68.32,71.66 | v71.57,75.52 72.08,75.52 72.58,75.01 73.3,75.01 73.35,75.06 | v66.79,74.58 68.24,73.13 v69.79,73.13 | R27.2 53.8,42.74 54.6,43.54 U$8.2 | J4.3 43.17,61.32 41.48,61.32 39.78,63.02 35.86,63.02 35.14,62.3 35.14,62.13 | J3.3 65.22,61.32 65.22,63.01 63.41,64.81 v63.41,65.51 | v63.41,68 63.41,69.7 v63.06,70.06
  Bottom(3v3GND) 0.254: 68.32,71.66 v69.79,73.13 | v74.06,77.4 74.31,77.14 74.31,76.03 73.35,75.06 | v43.35,88.47 v46.02,88.47
  Bottom(3v3GND) 0.305: C5.1 98.85,109.55 99.36,109.05 100.25,109.05 CAP_SENSE_BUF.5 | 100.32,107.12 100.32,105.95 v102,104.27
  Bottom(3v3GND) 0.406: CAP_SENSE_BUF.5 100.32,107.12 96.84,107.12 95.24,108.72 95.24,115.47 96.31,116.54 102.89,116.54 103.45,115.97 CLAMP1.C
5V  (via drill 0.35)
  Top(3v3+) 0.152: U$17.9 25.64,45.68 v25.72,45.6 | v29.63,45.42 29.96,45.09 29.96,44.71 30.29,44.38 U$17.18 32.77,44.38 v37.68,49.29 | U$21.18 116.06,47.45 114.96,48.56 114.18,48.56 U$21.9 113.79,48.95 113.02,48.95 112.46,49.51 v109.64,49.51
  Top(3v3+) 0.203: C36.1 20.77,46.19 C35.1 21.95,46.17 22.44,45.68 U$17.9 | U$21.18 U$21.17 C38.1 123.74,46.08 124.58,45.24 v124.4,45.24 | 31.04,44.35 U$17.18
  Top(3v3+) 0.254: C37.1 123.77,46.78 C38.1
  Top(3v3+) 0.61: J5.1 J8.1
  Bottom(3v3GND) 0.152: v25.72,45.6 29.45,45.6 v29.63,45.42 | 100.04,57.51 108.04,49.51 v109.64,49.51 | v37.68,49.29 38.48,49.29 U$14.VIN | R32.2 65.08,43.51 69.05,43.51 69.23,43.69 69.23,44.87 65.23,48.87 61.49,48.87 60.93,49.44 60.93,50.22 60.39,50.75 59.97,50.75 57.64,53.08 53.29,53.08
  Bottom(3v3GND) 0.203: v58.08,65.33 59.86,65.33 60.04,65.16
  Bottom(3v3GND) 0.406: R34.2 R33.2 R32.2
  Bottom(3v3GND) 0.61: C40.1 53.29,53.08 60.04,59.82 60.04,65.16 60.04,66.75 78.35,66.75 | 78.35,66.75 81.37,66.75 J6.1 J7.1 92.57,64.98 100.04,57.51 100.04,30.66 94.71,25.33 J5.1 | 78.35,66.75
  Bottom(3v3GND) 0.813: C40.1 C39.1 44.59,53.08 C41.1 40.96,52.73 | 40.96,52.73 5REG.SOURCE | U$14.VIN 39.95,50.75 39.95,52.71 39.97,52.73 40.96,52.73
12V  (via drill 0.3, 0.35)
  Top(3v3+) 0.152: R17.2 115.05,116.25 v114.98,116.18
  Top(3v3+) 0.305: C4.1 57.63,72.41 C7.1
  Top(3v3+) 0.406: C7.1 57.6,70.79 58.08,70.31 v58.79,70.31 | U$4.1 76.1,78.78 76.39,78.49 76.39,77.78 76.57,77.6 v77.64,77.6 | U$1.1 65.12,79.66 v65.55,80.09
  Top(3v3+) 0.61: v118.8,106.77 119.42,107.39 119.42,110.44 PW_LED1.A | R23.1 7.4,101.79 7.41,101.78 v7.41,101.07
  Top(3v3+) 1.016: 3.3REG1.GATE 95.62,64.82 95.6,64.8 v95.24,65.16
  12V+ 0.406: v77.64,77.6 v78.88,77.6
  Bottom(3v3GND) 0.203: U$18.8 89.02,88.47 89.02,89.16 90.07,90.2 C33.1 v88.14,90.41 v88.13,90.4
  Bottom(3v3GND) 0.406: C2.1 78.88,79.21 | 78.88,79.21 80.44,79.21 C3.1 | v78.88,77.6 78.88,79.21
  Bottom(3v3GND) 0.813: 5REG.GATE 40.12,58.17 40.12,59.29 v37.99,61.42
  pour 12V+: -11.79,135.56 -11.79,15.55 17.19,-13.43 132.4,-13.43 151.96,6.13 151.96,125.96 131.51,146.41 -0.95,146.41
12V-KICKER
  Top(3v3+) 0.254: C18.1 52.86,95.57 52.49,95.2 52.49,95.08 | 52.49,95.08 52.49,94.6 CHARGE_U.P$1 52.46,94.57 53.38,94.57 53.51,94.44 53.51,93.17 53.39,93.05 CHARGE_U.P$4 | 48.03,96.11 48.79,96.11 49.7,95.2 52.37,95.2 52.49,95.08 | 48.02,96.12 C23.1
  Top(3v3+) 0.61: 82.97,98.46 83.35,98.84 83.35,103.33 82.34,104.35 69.89,104.35 66.34,100.79 36.8,100.79 35.6,99.6 35.6,97.87 37.25,96.22 40.68,96.22 40.65,96.19 40.65,96.12
  Top(3v3+) 0.813: C20.1 C21.1 48.03,96.11 C23.1 | 40.65,96.12 48.02,96.12 48.05,96.09 C34.1
  Top(3v3+) 1.676: 85.26,95.97 85.26,98.44 U$3.P$4 82.97,98.46 U$3.P$5
  Top(3v3+) 1.78: 85.26,95.97 87.98,93.25 95.6,93.25 104.51,84.33 KICKER1.2
12VGND  (via drill 0.3, 0.35, 0.38, 0.8, 1.1 pad 2.79)
  Top(3v3+) 0.152: R13.2 11.32,108.54 10.25,109.61 10.25,110.85 13.1,113.69 14.88,113.69 16.38,112.19 U$5.3 | U$12.+ 126.08,100.81 120.67,106.23 120.67,112.22 R21.1 119.98,113.7 12VGND.P$1 | v103.06,112.63 109.19,112.63 v112.46,115.9 | v96.84,114.23 91.31,114.23 C14.- | C14.- 98.44,123.36 v98.44,124.01 | C14.- 82.55,115.23 v73.73,106.4 | NEON.2 66.76,100.46 66.56,100.26 59.33,100.26 C19.2 | 37.18,123.19 51.62,123.19 C6.- | U$19.1 89.87,42.75 90.22,43.11 v94.3,43.11 | U$1.2 63.72,79.19 63.72,79.44 63.59,79.58 62.85,79.58 60.77,77.49 60.14,77.49
  Top(3v3+) 0.203: 64.15,78.73 U$1.2 | R21.1 v118.66,112.9 v118.66,112.91 | R18.1 v116.68,117.33 | BATCLAMP2.A 112.48,115.92 v112.46,115.9
  Top(3v3+) 0.254: 16.38,113.1 16.38,113.14 | 74.32,79.24 U$4.2
  Top(3v3+) 0.305: 35.59,121.6 31.93,125.26 24.49,125.26 16.38,117.15 16.38,113.14 | 16.38,113.1 U$5.3 | C7.2 60.12,75.23 C4.2 | 52.37,92.16 51.48,92.16 51.6,92.03 53.38,92.03 53.51,92.16 53.51,92.41 53.38,92.28 51.48,92.28 51.48,92.54 53.51,92.54 53.5,92.55 CHARGE_U.P$5 54.28,92.55 54.52,92.79 | 54.52,92.79 54.52,97.11 54.02,97.62 51.35,97.62 51.1,97.36 | 54.52,92.79 54.52,92.66 54.4,92.54 54.65,92.54 54.78,92.66 54.78,99.27 55.54,100.03 57.95,100.03 57.95,98.95 C19.2 57.95,98.88 57.95,96.36 RBG.1 | v37.28,109.61 v37.27,109.61 R25.2
  Top(3v3+) 0.508: U$4.2 74.32,80.21 v74.26,80.27 | U$1.2 64.17,80.05 v64.13,79.91 | C4.2 60.14,77.49 59.86,77.78 v59.5,77.78
  Top(3v3+) 0.61: 52.37,92.16 52.37,89.87 51.1,88.6 RSENSE.1 | U$19.1 88.34,42.97 88.31,42.93 v88.13,42.93
  Top(3v3+) 0.813: C18.2 51.1,96.41 51.1,97.36 51.1,98.25 50.42,98.92 C23.2 48.03,98.92 C21.2 C20.2 41.91,98.89 C34.2 v36.75,98.89 v36.74,98.88
  Top(3v3+) 1.27: RSENSE.1 49.59,85.83 v49.55,85.78 | v96.56,79.58 98.77,79.58 v99.86,78.49
  Top(3v3+) 1.676: 37.18,123.19 35.59,121.6 U$6.LEFT
  Top(3v3+) 1.93: U$3.P$10 96.53,79.55 v96.56,79.58
  12VGND 0.508: v74.26,80.27 74.26,80.98 73.73,81.51 | v64.13,79.91 64.13,80.62 63.59,81.16
  12VGND 1.27: v49.55,85.78 49.55,84.71 48.48,83.65
  Bottom(3v3GND) 0.152: C5.2 97.7,111.43 | CLAMP2.A 100.14,114.71 100.22,114.63 | v116.68,117.33 116.68,114.89 116.78,114.79 | 116.78,114.79 v118.66,112.91 | 116.78,114.79 112.51,114.79 112.36,114.94 | 101.27,114.37 101.32,114.37 v103.06,112.63 | v73.73,106.4 71.01,103.68 NEON.2 71.01,96.68 76.22,91.47 76.22,84.89 73.68,82.36 73.68,82.22 | 75.5,81.87 74.91,81.87 74.51,81.47 74.02,81.47 73.68,81.81 73.68,82.22 | 73.68,82.22 72.1,80.64 72.1,80.16 71.42,79.48 65.3,79.48 64.87,79.91 v64.13,79.91 | C3.2 94.18,81.97 v96.56,79.58 | 131.7,31.37 BATT.2 | 94.53,43.11 v94.3,43.11
  Bottom(3v3GND) 0.203: v112.46,115.9 112.46,115.04 112.36,114.94
  Bottom(3v3GND) 0.305: 99.92,114.63 100.22,114.63 101.01,114.63 101.27,114.37 CAP_SENSE_BUF.2 101.27,112.72 101.01,112.98 98.34,112.98 97.7,112.35 97.7,111.43 | R15.1 99.88,124.35 99.69,124.36 98.62,124.36 v98.44,124.01 | v74.26,80.27 74.26,80.62 75.5,81.87 77.69,81.87 77.78,81.97
  Bottom(3v3GND) 0.406: 81.02,81.43 C3.2 77.78,81.97 C2.2 | DRIB_TRAN.SOURCE 22.94,84.65 v23.77,83.82
  Bottom(3v3GND) 0.508: CLAMP2.A 97.32,114.71 v96.84,114.23
  Bottom(3v3GND) 0.813: Q2.S 27.63,84.59 v27.68,84.53 | U$13.2 11.22,24.19 v11.14,24.26 | BATT.2 129.39,31.37 v126.18,34.57
  Bottom(3v3GND) 1.016: Q3.S 13.22,56.75 v13.28,56.8
  pour 12VGND: -16.59,149.25 167.07,149.25 167.07,-24.28 167.78,-24.99 -16.59,-24.99
BAT+
  Top(3v3+) 1.27: ON/OFF.IN1 136.87,46.51 136.85,46.49 139.25,46.49 | 141.47,46.49 139.25,46.49 | 139.25,46.49 ON/OFF.IN1 | ON/OFF.IN1 139.23,44.07 139.16,44 139.16,51.28 | 139.16,52.89 139.16,51.28 | ON/OFF.COM 141.21,51.21 141.29,51.29 139.15,51.29 | 139.15,51.29 136.67,51.29 | 139.16,51.28 139.15,51.29 | BATT.1 132.04,34.76 132.05,34.75 132.05,38.13 132.04,38.14 | 132.04,38.14 131.87,38.31 | 132.04,38.14 BATT.1 | 134.54,36.35 132.05,36.35 BATT.1 | 129.56,36.35 129.57,36.37 BATT.1
  pour Top(3v3+): 139.34,33.86 130.09,33.86 128.67,35.28 128.67,40.97 129.91,42.22 131.69,42.22 132.22,42.75 132.22,52.18 133.47,53.42 141.82,53.42 142.36,52.89 142.36,36.88
BATSENSE  (via drill 0.35, 0.5)
  Top(3v3+) 0.152: U$14.23/A9 34.58,61.91 v29.28,61.91 | v110.35,124.01 112.48,121.88 BATCLAMP2.C
  Top(3v3+) 0.254: BAT.P$1 116.68,121.1 R18.2 116.66,120.42 R17.1 114.85,120.62 114.85,121.24 114.54,121.55 BATCLAMP2.C | 112.48,122.04 v115.36,124.92
  Top(3v3+) 0.406: BATCLAMP2.C 112.48,122.04
  Bottom(3v3GND) 0.152: v29.28,61.91 29.28,84 31.05,85.78 31.05,97.69 31.41,98.05 37.63,98.05 50.79,111.2 68.39,111.2 87.06,129.87 104.49,129.87 v110.35,124.01
BB_IN
  Top(3v3+) 0.152: BB_CON.2 97.94,23.41 98.97,24.44 98.97,29.95 94.91,34.01 U$14.31/A12
BB_OUT
  Top(3v3+) 0.152: R19.1 93.04,16.86 93.82,16.08 99.51,16.08 99.86,16.44 99.86,32.19 U$14.32/A13
BREN0
  Top(3v3+) 0.152: J1.6 45.69,22.94 44.03,22.94 43.35,23.62 43.35,24.39 42.46,25.28 41.49,25.28 41.19,24.97 32.3,24.97 29.45,27.82 23.23,27.82 13.45,37.6 13.45,47.55 15.48,49.58 U$17.3
BREN1  (via drill 0.35)
  Top(3v3+) 0.152: U$21.26 121.24,52.71 124.22,52.71 126.36,54.84 126.36,67.64 v125.82,68.18 | J3.6 71.57,64.98 73.37,64.98 77.64,69.24 v80.48,69.24
  Bottom(3v3GND) 0.152: v80.48,69.24 83.66,69.24 84.73,70.31 92.66,70.31 94.03,68.94 121.86,68.94 122.34,68.46 125.54,68.46 v125.82,68.18
BREN2
  Top(3v3+) 0.152: J4.6 45.3,64.27 10.96,64.27 8.3,61.6 8.3,38.84 22.24,24.9 26.69,24.9 37.81,13.77 103.6,13.77 105.55,15.73 105.55,49.08 108.93,52.46 113.79,52.46 U$21.3
BREN3
  Top(3v3+) 0.152: J2.6 67.91,22.94 66.26,22.94 65.57,23.62 65.57,24.39 64.69,25.28 63.72,25.28 63.59,25.15 55.95,25.15 50.79,30.31 34.26,30.31 27.5,37.06 27.5,49.15 27.93,49.58 U$17.26
CAP+  (via drill 0.7)
  Top(3v3+) 0.813: 28.44,102.95 29.63,104.14 29.63,114.94 27.29,117.28 U$7.+
  Top(3v3+) 1.016: v27.98,102.95 28.44,102.95
  Top(3v3+) 1.27: CHIP.1 1.87,94.1 1.54,93.77 1.54,83.47 | 1.54,83.47 | KICK.1 1.54,83.47
  Top(3v3+) 2.184: C6.+ 65.36,115.19 75.61,125.43 90.27,125.43 C14.+
  Bottom(3v3GND) 0.203: 3.42,81.76 KICK.1
  Bottom(3v3GND) 0.305: C14.+ 101.16,125.39 R14.2
  Bottom(3v3GND) 0.61: R24.2 77.79,101.46 CHARGE_D.C | CAP+_TEST.P$1 33.42,102.93 33.44,102.95
  Bottom(3v3GND) 0.813: KICK_FLY.CATHODE 8.79,84.64 | CHIP_FLY.CATHODE 9.09,97.08
  Bottom(3v3GND) 1.016: 27.93,102.9 v27.98,102.95
  Bottom(3v3GND) 1.27: 8.79,84.64 5.58,84.64 3.42,82.48 3.42,81.76 | CHIP.1 4.52,95.26 6.34,97.08 9.09,97.08 9.09,98.69 11.12,100.72 11.12,101.66 12.36,102.9 27.93,102.9
  Bottom(3v3GND) 1.778: C6.+ 48.6,115.19 36.36,102.95 33.44,102.95 v27.98,102.95 | 90.27,125.43 C14.+
  Bottom(3v3GND) 2.184: C14.+ 87,125.39 84.37,122.76 84.37,108.24 CHARGE_D.C
CHARGE  (via drill 0.5, 0.6)
  Top(3v3+) 0.203: v48.05,92.66 50.33,92.66 51.22,93.55 CHARGE_U.P$3
  Top(3v3+) 0.305: CHARGE_LED.A v34.84,92.54
  Bottom(3v3GND) 0.152: U$14.0/RX 41.57,34.78 30.88,45.47 30.88,80.45 33.58,83.15 38.34,83.15 38.34,83.11 39.59,81.87 41.72,81.87 41.72,82.26 42.61,83.15 CHARGE.P$1
  Bottom(3v3GND) 0.178: CHARGE.P$1 45.5,83.15 45.81,83.47 50.26,83.47 51.5,84.71 51.5,87.05 46.54,92.02
  Bottom(3v3GND) 0.203: 47.16,91.39 47.16,91.77 v48.05,92.66
  Bottom(3v3GND) 0.305: v34.84,92.54 46.02,92.54 46.54,92.02 47.16,91.39
CHARGE_DONE  (via drill 0.35)
  Top(3v3+) 0.152: 37,84.28 36.31,84.28 34.79,82.76 v34.79,82.4
  Top(3v3+) 0.254: 41.32,94.05 41.3,94.06 38.02,94.06 37,93.04 37,84.28 37.81,83.47 40.42,83.47 DONE.P$1
  Top(3v3+) 0.305: CHARGE_U.P$2 42.21,94.05 41.32,94.05 41.18,94.05 40.94,93.81 40.94,92.95 R22.2 40.94,92.81 40.94,89.87 41.37,89.44 R12.2
  Bottom(3v3GND) 0.152: U$14.1/TX 35.42,43.29 34.26,43.29 31.41,46.13 31.41,79.38 34.43,82.4 v34.79,82.4
CHIP  (via drill 0.35)
  Top(3v3+) 0.152: 20.03,81.16 29.99,81.16 v36.39,74.76 | v39.95,74.76 56.06,74.76 56.63,74.18 62.3,74.18 62.35,74.22
  Top(3v3+) 0.203: ANDS.P$3 64.22,71.82 v64.13,71.91 | v63.24,74.05 62.53,74.05 62.35,74.22 62.26,74.31 62.26,78.4 62.6,78.75 U$1.3 | CHIP_LED.A 14.92,90.89 19.32,86.49 19.32,81.87 20.03,81.16
  Bottom(3v3GND) 0.152: v36.39,74.76 v39.95,74.76
  Bottom(3v3GND) 0.203: v64.13,71.91 63.24,72.8 v63.24,74.05
CHIP_ENABLE  (via drill 0.35)
  Top(3v3+) 0.152: ANDS.P$6 73.11,71.82 73.19,71.73 73.19,69.42 72.05,68.27 66.86,68.27 66.07,69.07 61.1,69.07 v60.93,69.24 | U$14.5 54.27,43.46 54.98,44.17 59.15,44.17 60.32,45.34 60.32,50.24 57.43,53.12 57.43,65.75 58.01,66.33 v58.9,66.33 | v43.68,68.53 32.58,79.63 32.58,82.76 32.58,82.83 30.52,84.89 30.52,88.45 29.99,88.98 26.43,88.98 23.66,91.75
  Top(3v3+) 0.203: 18.45,91.47 CE_LED.A 23.66,91.75
  Bottom(3v3GND) 0.152: v43.68,68.53 59.5,68.53 60.21,69.24 v60.93,69.24 58.9,67.22 v58.9,66.33
COMP_OUT  (via drill 0.3)
  Top(3v3+) 0.203: R29.2 68.39,75.19 68.39,76 68.93,76.53 68.93,80.62 69.46,81.16 69.46,84.36 69.52,84.42 U$22.G 71.36,84.42 71.59,84.18 71.59,83.11 72.66,82.05 v74.27,82.05
  Top(3v3+) 0.254: ANDS.P$5 70.43,71.17 68.52,73.08 | 68.52,73.08 66.89,73.08 ANDS.P$1 | 68.52,73.08 68.52,74.8 R29.2
  Bottom(3v3GND) 0.203: U$18.7 79.15,87.11 74.26,82.22 v74.26,82.05 v74.27,82.05
CTS  (via drill 0.35)
  Top(3v3+) 0.152: R30.1 119.83,71.8 119.83,70.91 118.69,69.77 117.8,69.77 100.75,52.72 100.75,52.35 v99.15,50.75
  Bottom(3v3GND) 0.152: v99.15,50.75 98.42,50.02 98.42,49.44 90.71,41.73 87.89,41.73 87.55,41.39 87.55,41 85.61,39.06 85.61,39.02 85.46,39.02 85.15,38.71 84.35,38.71 84.05,39.02 81.55,39.02 U$14.24
DIR0
  Top(3v3+) 0.152: J1.8 43.25,22.84 33.37,22.84 29.01,27.2 23.14,27.2 12.74,37.6 12.74,48.26 14.71,50.23 U$17.2
DIR1  (via drill 0.35)
  Top(3v3+) 0.152: U$21.27 121.38,53.5 122.16,53.5 123.69,55.03 v123.69,69.07 | v83.33,70.67 77.46,70.67 72.3,65.51 69.28,65.51 66.56,62.79 J3.4
  Bottom(3v3GND) 0.152: v123.69,69.07 123.51,69.24 99.13,69.24 97.64,70.74 83.4,70.74 v83.33,70.67
DIR2
  Top(3v3+) 0.152: J4.4 43.63,62.51 42.46,63.68 11.09,63.68 8.96,61.55 8.96,38.92 22.37,25.52 27.31,25.52 38.17,14.66 103.24,14.66 104.31,15.73 104.31,49.15 108.46,53.3 U$21.2
DIR3
  Top(3v3+) 0.152: 66.79,21.52 J2.8 65.57,22.74 63.72,22.74 63.64,22.66 57.55,22.66 50.79,29.42 33.9,29.42 26.97,36.35 26.97,49.51 27.69,50.23 U$17.27
DISCHARGE  (via drill 0.35)
  Top(3v3+) 0.152: R26.1 17.22,101.57 v17.37,101.43 | U$14.4/CANRX 49.64,32.51 v36.57,32.51
  Bottom(3v3GND) 0.152: v36.57,32.51 3.25,32.51 3.14,32.62 3.14,67.82 3.67,68.36 18.43,68.36 27.85,77.78 27.85,83.01 30.75,85.91 30.75,98.49 28.35,100.89 17.9,100.89 v17.37,101.43
DIVCAP
  Bottom(3v3GND) 0.203: R8.1 102.18,109.02 102.15,109.05
  Bottom(3v3GND) 0.254: R8.1 103.79,110.15 104.13,110.49 112.49,110.49 114.28,108.7 CAP/100.P$1
  Bottom(3v3GND) 0.305: CAP_SENSE_BUF.1 100.32,110.75 100.5,110.57 102.15,110.57 102.15,109.05 CAP_SENSE_BUF.4
DRIB  (via drill 0.35)
  Top(3v3+) 0.152: v30.17,83.11 27.68,83.11 23.06,87.72 DRIB_TEST.P$1
  Bottom(3v3GND) 0.152: U$14.6 55.64,34.6 54.67,33.63 41.17,33.63 40.61,34.2 40.61,34.45 30.17,44.89 30.17,45.09 30.24,45.17 30.24,45.67 30.17,45.74 v30.17,83.11
  Bottom(3v3GND) 0.203: 23.04,87.73 DRIB_TEST.P$1
  Bottom(3v3GND) 0.305: DRIB_TEST.P$1 23.03,89.93 DRIB_TRAN.GATE
ENABLE0  (via drill 0.35)
  Top(3v3+) 0.152: U$17.4 16.43,48.93 14.16,46.66 14.16,37.77 23.77,28.17 v30.88,28.17
  Bottom(3v3GND) 0.152: J1.4 47.31,19.28 39.77,19.28 v30.88,28.17
ENABLE1  (via drill 0.35)
  Top(3v3+) 0.152: U$21.25 124.58,52 126.89,54.31 126.89,65.69 v127.78,66.58 | v84.93,69.6 84.75,69.78 82.26,69.78 80.31,67.82 78,67.82 74.08,63.91 73.04,63.91 J3.8
  Bottom(3v3GND) 0.152: v84.93,69.6 85.97,69.6 86.14,69.77 91.14,69.77 92.05,69.77 93.28,68.53 121.56,68.53 122.62,67.47 127.25,67.47 127.78,66.93 v127.78,66.58
ENABLE2  (via drill 0.35)
  Top(3v3+) 0.152: U$21.4 113.83,51.85 v109.29,51.85 | v58.97,60.71 60.88,58.8 64.51,58.8 65.19,59.49 65.19,60.89 65.65,61.34 69.59,61.34 69.6,61.36 71.15,61.36 71.16,61.34 74.67,61.34 74.68,61.36 79.72,66.4 82.8,66.4 v83.94,67.54
  Bottom(3v3GND) 0.152: v109.29,51.85 100.61,60.53 97.77,60.53 91.32,66.98 86.11,66.98 85.47,66.35 84.8,66.35 83.94,67.22 v83.94,67.54 | J4.8 50.48,62.51 51.65,63.68 56,63.68 v58.97,60.71
ENABLE3
  Top(3v3+) 0.152: J2.4 70.45,22.94 68.8,22.94 68.11,23.62 68.11,25.28 67.53,25.86 56.3,25.86 50.97,31.2 34.61,31.2 28.21,37.6 28.21,48.62 28.52,48.93 U$17.25
FAULT0  (via drill 0.35)
  Top(3v3+) 0.152: U$17.5 17.35,48.28 14.7,45.63 14.7,38.13 21.45,31.37 v22.52,31.37
  Bottom(3v3GND) 0.152: v22.52,31.37 35.14,18.75 49.37,18.75 52.14,21.52 J1.2
FAULT1  (via drill 0.35)
  Top(3v3+) 0.152: J3.10 78.43,66.75 80.66,66.75 82.44,68.53 v84.75,68.53 | U$21.24 121.25,51.29 124.58,51.29 127.42,54.13 127.42,62.67 v128.49,63.73
  Top(3v3+) 0.254: U$21.24 121.12,51.29
  Bottom(3v3GND) 0.152: v84.75,68.53 85.61,68.53 86.14,68 95.59,68 97.02,66.58 125.64,66.58 v128.49,63.73
FAULT2  (via drill 0.35)
  Top(3v3+) 0.152: v58.44,59.64 59.61,59.64 60.75,58.5 76.77,58.5 82.07,63.81 84.19,63.81 84.32,63.94 84.32,66.05 v85.6,67.33 | v112.13,51.24 113.88,51.24 U$21.5
  Bottom(3v3GND) 0.152: J4.10 55.01,59.64 v58.44,59.64 | v85.6,67.33 95.02,67.33 111.11,51.24 v112.13,51.24
FAULT3
  Top(3v3+) 0.152: J2.2 72.99,22.94 71.34,22.94 70.65,23.62 70.65,25.28 69.18,26.75 56.66,26.75 51.5,31.91 35.14,31.91 28.74,38.31 28.74,47.55 28.92,47.73 29.74,47.73 30.1,48.08 30.87,48.08 U$17.24
GND  (via drill 0.3, 0.35, 1)
  Top(3v3+) 0.152: J8.3 87.6,20.25 | 87.6,20.25 J5.3 | 24.06,44.83 U$17.10 25.22,45.03 v25.72,44.53 | v29.35,44 29.62,43.73 U$17.17 | 38.55,47.7 40.69,49.84 U$14.AGND 42.54,48.87 47.05,48.87 | 94,21.42 93.72,21.14 93.72,20.77 93.23,20.28 92.54,20.28 91.69,19.42 91.69,18.93 90.01,17.25 90.01,17.22 89.32,16.54 88.36,16.54 87.67,17.22 87.67,20.17 87.6,20.25 | J2.9 62.2,24.11 v62.17,24.08 | U$21.15 116.59,45.5 115.09,47 115.09,47.77 114.96,47.91 114.18,47.91 U$21.10 112.5,48.1 v112.49,48.09 | C38.2 124.47,49.33 126.53,49.33 127.6,48.26 127.6,46.49 125.47,44.35 v121.2,44.35 | C15.2 68.92,69.1 68.9,69.13 68.9,69.8 68.71,69.98 65.41,69.98 65.22,70.17 65.22,70.45 65.41,70.64 66.33,70.64 ANDS.P$4 67.05,71.37 67.7,71.37 67.83,71.5 67.83,72.1 v68.13,72.4 | v64.48,70.67 60.21,70.67 58.26,68.71 v58.26,67.82 | v58.26,67.82 62.86,63.22 62.86,62.03 64.03,60.86 J3.1 | U$5.2 16.42,105.69 v18.08,105.69 17,104.62 16.73,104.62 16.05,103.95 16.05,103.1 15.06,102.11 13.14,102.11 12.02,103.23 8.8,103.23 8.67,103.1 8.67,102.11 11.15,99.62 14.51,99.62 R10.1 | 19.08,94.03 18.97,93.92 18.72,93.92 17.37,92.56 14.12,92.56 13.99,92.43 13.99,91.04 17.99,87.05 R4.2 | 19.08,94.03 19.1,94.05 19.1,97 R5.2 | 19.08,94.03 19.08,93.85 20.84,92.08 23.8,92.08 26.59,89.28 30.12,89.28 30.24,89.16 30.34,89.16 30.88,88.62 30.88,88.48 | U$17.16 U$17.17 | U$17.17 33.46,43.73 34.84,45.11 34.84,45.59 36.98,47.73 v38.52,47.73 | v99.33,59.82 96.02,59.82 3.3REG1.DRAIN 94.45,59.9 J7.3 | GND.P$1 86.51,59.84 v86.53,59.82 86.45,59.9 J6.3 74.59,51.34 U$14.GND2 | C11.2 93.67,72.09 102.35,72.09 102.35,72.12 102.78,72.55 102.78,73.05 102.43,73.41 95.88,73.41 94.94,74.35 94.94,80.25 95.24,80.56 95.24,81.68 v94.35,82.57
  Top(3v3+) 0.152: J4.1 43.25,61.24 47.44,61.24 48.3,62.11 48.3,64.77 | 48.3,64.77 33.01,80.06 33.01,84.53 30.88,86.67 30.88,88.48 | 30.88,88.48 R11.2 | 48.3,64.77 51.35,67.82 v58.26,67.82 | 47.05,48.87 47.62,49.44 47.62,50.24 47.23,50.62 v47.23,54.02 | 47.05,48.87 47.05,48.26 47.62,47.7 47.62,46.46 v48.28,45.8 | v71.81,78.14 71.81,78.53 71.5,78.84 71.5,80.36 71.42,80.45
  Top(3v3+) 0.203: U$22.S 70.53,82.43 70.53,81.34 71.42,80.45 | R4.2 15.54,85.67 R9.1 15.51,86.39 v12.56,89.34 | R11.2 31.94,89.55 v31.94,90.94 | 16.4,105.69 U$5.2 | U$17.10 22.66,45.03 21.99,44.35 20.81,44.35 C35.2 | C35.2 18.69,44.37 C36.2 | C35.2 20.79,43.16 20.74,43.11 v20.74,42.93 | U$17.16 U$17.15 31.07,41.34 31.05,41.33 v31.05,40.97 | ANDS.P$4 64.98,71.17 v64.48,70.67
  Top(3v3+) 0.254: U$5.2 | U$21.16 U$21.15 121.19,44.54 121.2,44.53 v121.2,44.35 | C38.2 125.67,48.61 C37.2 126.75,48.58 126.89,48.44 v126.89,47.73
  Top(3v3+) 0.305: R10.1 17.38,98.67 R5.2 17.3,98.59 | BB_CON.5 95.06,17.41 94,18.47 94,21.42 94.05,21.47 C12.2 97.63,21.47 BB_CON.3 | v86.53,71.73 86.53,68.91 GND.P$1 | C10.1 122.8,96.62 121.91,95.74 v121.91,95.91
  Top(3v3+) 0.61: U$19.2 89.64,41.15 v88.13,41.15
  Top(3v3+) 1.016: C9.2 95.18,71.05 C8.2 93.45,71.04 C11.2 | C11.2 | C11.2 91.44,71.45 v91.15,71.73
  Top(3v3+) 2.54: 3.3REG1.DRAIN 95.28,53.99 95.24,53.95 v95.24,53.78
  Bottom(3v3GND) 0.152: J4.1 44.98,56.98 | 44.98,56.98 46.35,56.98 46.35,54.95 | 46.35,54.95 C39.2 46.55,54.88 47.23,54.19 v47.23,54.02 | J1.9 39.03,27.05 U$14.GND 32.66,40.97 v31.05,40.97 | U$14.GND2 74.59,51.93 74.81,52.15 74.81,53.14 74.68,53.28 73.22,53.28 R47.2 71.97,54.52 71.47,54.52 70.81,53.87 69.43,53.87 68.77,54.52 R55.2 67.46,53.82 65.41,53.82 64.81,54.42 R45.2 64.03,54.55 61.59,54.55 60.86,53.82 59.47,53.82 59.34,53.95 59.34,56.03 60.97,57.66 61.71,57.66 J3.1 | v25.72,44.53 28.82,44.53 v29.35,44 | 82.16,29.76 R49.2 80.89,29.76 80.16,30.49 78.77,30.49 78.04,29.76 77.28,29.76 R57.2 76.38,30.66 68.75,30.66 | 82.16,29.76 82.79,30.39 84.43,30.39 | 84.43,30.39 R59.2 87.11,29.74 R51.2 | 84.43,30.39 84.94,30.91 85.78,30.91 85.91,31.04 85.91,38.93 v88.13,41.15 | 82.16,29.76 82.16,26.54 81.98,26.36 81.98,21.42 J8.3 | v62.17,24.08 68.75,30.66 | 68.75,30.66 68.22,31.2 68.22,35.82 65.02,39.02 60.57,39.02 59.49,40.1 C13.1 56.52,40.44 56,40.97 U$8.1 56.73,43.01 57.2,43.01 57.33,43.14 57.33,43.94 57.2,44.07 54.67,44.07 54.46,43.87 50.1,43.87 49.44,43.21 48.94,43.21 48.58,43.57 48.58,44.07 48.67,44.16 48.67,45.41 v48.28,45.8 | 35.17,53.57 5REG.DRAIN 35.17,50.19 37.63,47.73 v38.52,47.73 | v121.91,95.91 121.91,89 U$15.10 111.39,83.51 110.05,82.18 100.66,82.18 98.02,84.82 96.38,84.82 96.31,84.89 94.63,84.89 U$18.4 | v112.49,48.09 112.13,48.09 100.4,59.82 v99.33,59.82 | v86.53,59.82 88.76,59.82 J7.3 | v86.53,71.73 v91.15,71.73 | v94.35,82.57 94.31,82.62 U$18.4 | U$18.4 93.56,85.31 93.11,85.31 92.98,85.45 92.98,87.5 93.11,87.64 93.56,87.64 U$18.1 92.87,89.82 C33.2 | 46.35,54.95 48.05,54.95 C40.2
  Bottom(3v3GND) 0.152: C41.2 44.98,56.27 44.98,56.98 | v68.13,72.4 65.9,74.05 65.9,75.99 66.27,76.35 70.02,76.35 v71.81,78.14
  pour Bottom(3v3GND): 66.08,-10.59 117.47,-10.59 146.09,18.04 146.09,109.07 111.42,143.74 33.01,143.74 -5.04,105.69 -5.04,20.53 25.72,-10.23 65.73,-10.23
INT1  (via drill 0.35)
  Top(3v3+) 0.152: U$17.20 32.38,45.68 v33.01,46.31
  Bottom(3v3GND) 0.152: U$14.9/CS 59.83,39.2 57.34,39.2 54.49,42.04 37.28,42.04 v33.01,46.31
INT2
  Top(3v3+) 0.152: U$14.39/A20 82.21,49.53 82.95,48.8 102.28,48.8 107.89,54.41 114.96,54.41 120.08,49.28 120.08,49.08 120.22,48.95 120.99,48.95 U$21.20
KICK  (via drill 0.35, 0.5)
  Top(3v3+) 0.152: v32.02,73.87 26.27,73.87 20.4,79.73 16.13,79.73 KICK_LED.A
  Top(3v3+) 0.203: v72.18,79.12 72.48,79.12 72.84,78.77 73.36,78.77 U$4.3
  Top(3v3+) 0.254: U$4.3 73.37,77.88 72.58,77.09 72.58,75.06 72.84,74.81 72.84,72.62 72.69,72.47 ANDS.P$7
  Bottom(3v3GND) 0.152: 54.17,75.82 52.21,73.87 42.23,73.87 42.15,73.94 41.65,73.94 41.58,73.87 v32.02,73.87
  Bottom(3v3GND) 0.203: v72.18,79.12 68.57,79.12 65.27,75.82 54.17,75.82
KICK_ENABLE  (via drill 0.35)
  Top(3v3+) 0.152: ANDS.P$2 64.43,72.47 63.46,73.44 58.62,73.44 58.6,73.46 42.03,73.46 v41.9,73.33 | v34.26,73.16 23.94,73.16 | 23.94,73.16 23.91,73.16 18.25,78.81 | v28.31,22.41 26.13,24.59 22.11,24.59 7.81,38.89 7.81,62.08 10.48,64.75 15.54,64.75 23.94,73.16 | v57.9,28.35 59.35,29.8 U$14.7
  Top(3v3+) 0.203: 18.25,78.81 KE_LED.A
  Bottom(3v3GND) 0.152: v41.9,73.33 34.43,73.33 v34.26,73.16 | v28.31,22.41 33.04,17.68 49.9,17.68 53.31,21.08 53.31,23.75 v57.9,28.35
KICK_REF  (via drill 0.35)
  Top(3v3+) 0.152: v86.35,53.78 87.67,55.1 87.67,70.74 89.73,72.8 v102.17,72.8
  Bottom(3v3GND) 0.152: U$14.A22/DAC1 81.07,53.78 v86.35,53.78
  Bottom(3v3GND) 0.203: R37.1 102.17,79.34 v102.17,72.8
LOCKN0
  Top(3v3+) 0.152: J1.10 33.57,21.57 28.57,26.57 23.05,26.57 12.03,37.6 12.03,48.62 14.29,50.88 U$17.1
LOCKN1  (via drill 0.35)
  Top(3v3+) 0.152: U$21.28 121.19,70.12 v121.38,70.31 | v81.55,71.91 77.64,71.91 71.77,66.04 67.55,66.04 J3.2
  Bottom(3v3GND) 0.152: v121.38,70.31 119.23,70.31 118.55,69.63 100,69.63 98.53,71.1 84.93,71.1 84.65,71.38 82.08,71.38 v81.55,71.91
LOCKN2
  Top(3v3+) 0.152: J4.2 41.44,63.05 11.17,63.05 9.72,61.6 9.72,39.02 22.88,25.86 28.21,25.86 38.88,15.19 102.71,15.19 102.89,15.37 102.89,48.62 108.22,53.95 U$21.1
LOCKN3
  Top(3v3+) 0.152: J2.10 57.22,21.57 50.26,28.53 33.55,28.53 26.34,35.73 26.34,50.13 27.09,50.88 U$17.28
LOWCHIP
  Bottom(3v3GND) 0.813: CHIP.2 3.44,92.62 | CHIP_FLY.ANODE 9.12,89.72
  Bottom(3v3GND) 1.27: 3.44,92.62 6.34,89.72 9.12,89.72 | CHIP_FLY.ANODE 9.23,91.59 12.95,95.31 16.52,95.31 18.93,92.89 Q2.D
LOWKICK  (via drill 0.8)
  Top(3v3+) 1.016: Q3.D 5.93,73.7 v5.93,77.08
  Bottom(3v3GND) 1.27: KICK_FLY.ANODE v5.93,77.08 KICK.2
M1QA-1
  Bottom(3v3GND) 0.203: J5.2 83.48,28.15 R58.2
M1QA-1OUT
  Bottom(3v3GND) 0.203: R58.1 85.06,31.56 R59.1 84.75,31.87 U$14.27
M1QA-2
  Bottom(3v3GND) 0.203: J6.2 80.08,62.44 74.26,56.62 60.39,56.62 60.21,56.44 60.21,54.5 R52.2
M1QA-2OUT
  Bottom(3v3GND) 0.203: R52.1 60.19,52.67 R53.1 61.89,52.44 U$14.17/A3
M1QA-3
  Bottom(3v3GND) 0.203: J7.2 88.54,62.13 85.28,62.13 84.93,61.78 84.93,56.27 84.04,55.38 70.53,55.38 70.12,54.97 R54.2
M1QA-3OUT
  Bottom(3v3GND) 0.203: R54.1 68.19,52.7 R55.1 66.97,51.53 U$14.15/A1
M1QA-4  (via drill 0.35)
  Top(3v3+) 0.203: J8.2 80.36,22.79 v75.15,28
  Bottom(3v3GND) 0.203: v75.15,28 75.15,29.79 R56.2
M1QA-4OUT
  Bottom(3v3GND) 0.203: R56.1 75.15,31.59 R57.1 78.53,32.86 78.53,34.57 78.55,34.6 U$14.25
M1QB-1  (via drill 0.3)
  Top(3v3+) 0.203: J5.4 89.93,17.71 91.33,19.11 91.33,29.59 91.15,29.77 v90.62,29.77
  Bottom(3v3GND) 0.203: v90.62,29.77 88.93,29.77 R50.2
M1QB-1OUT
  Bottom(3v3GND) 0.203: R50.1 88.89,31.56 R51.1 87.14,34.45 U$14.28
M1QB-2
  Bottom(3v3GND) 0.203: J6.4 81.88,56.09 66.61,56.09 66.11,55.58 R44.2
M1QB-2OUT
  Bottom(3v3GND) 0.203: R44.1 64.18,52.65 R45.1 64.15,50.12 U$14.16/A2
M1QB-3
  Bottom(3v3GND) 0.203: J7.4 85.93,54.45 R46.2
M1QB-3OUT
  Bottom(3v3GND) 0.152: 69.64,51.29 69.99,51.64 71.95,51.64
  Bottom(3v3GND) 0.203: R46.1 73.96,52.67 R47.1 71.95,52.6 71.95,51.64 | 69.64,51.29 69.51,51.16 U$14.14/A0
M1QB-4
  Bottom(3v3GND) 0.203: J8.4 80.64,17.71 79.24,19.11 79.24,29.63 R48.2
M1QB-4OUT
  Bottom(3v3GND) 0.203: R48.1 81.27,31.66 R49.1 81.37,32.44 82.26,33.33 82.26,34.55 U$14.26
N$1
  Top(3v3+) 0.152: DRAIN.P$1 58.96,83.11 58.97,83.11
  Top(3v3+) 0.61: 60.37,83.11 SWITCH_Q.DRAIN
  pour Top(3v3+): 58.59,89.36 75.73,89.36 86.66,78.31 86.66,73.99 86.4,73.74 80.43,73.74 79.92,74.25 79.92,81.49 74.34,86.82 68.62,86.82 67.61,85.81 67.61,81.61 58.59,81.61
N$2  (via drill 0.35)
  Top(3v3+) 0.152: v41.12,70.24 37.2,74.15 36.14,74.15 31.62,78.67 v26.43,78.67
  Top(3v3+) 0.203: U$4.5 75.27,74.81 v75.33,74.76
  Bottom(3v3GND) 0.152: v26.43,78.67 25.8,78.67 24.66,79.81 24.06,79.81 | v41.12,70.24 57.86,70.24 58.54,70.92 63.37,70.92 65.59,68.7 66.95,68.7 70.95,72.7 70.95,75.78 73.25,78.08 74.34,78.08 74.74,77.68 74.74,75.34 v75.33,74.76
  Bottom(3v3GND) 0.203: 24.06,79.81 R1.1
N$3
  Bottom(3v3GND) 0.406: R2.2 24.51,98.39 Q2.G
N$4
  Top(3v3+) 0.152: R28.2 138.33,93.6 U$15.16
N$5  (via drill 0.35)
  Top(3v3+) 0.152: v60.93,78.67 35.14,78.67 34.18,79.63 34.18,84.83 35.76,86.41 35.76,87.8 35.63,87.93 34.06,87.93 32.75,89.24 32.75,90.99 31.38,92.36 31.38,93.28 29.81,94.85 25.72,94.85 v25.01,95.56
  Top(3v3+) 0.203: U$1.5 64.13,77.14 v64.13,77.07
  Bottom(3v3GND) 0.203: R2.1 24.65,95.91 24.66,95.91 v25.01,95.56 | v64.13,77.07 62.53,78.67 v60.93,78.67
N$6
  Top(3v3+) 0.254: CHARGE_U.P$8 58.2,93.55 58.97,94.31 68.22,94.31 71.24,91.29 71.24,90.35 R31.1
N$7
  Top(3v3+) 0.305: C19.1 56.19,96.33 RBG.2 56.2,95.56 56.3,95.46 56.56,95.46 56.68,95.33 56.68,94.58 CHARGE_U.P$10
N$8  (via drill 0.35)
  Top(3v3+) 0.254: Q3.G 17.19,75.86 v17.19,75.82
  Bottom(3v3GND) 0.254: v17.19,75.82 18.12,75.82 22.21,79.91
  Bottom(3v3GND) 0.305: 22.21,79.91 R1.2
N$9  (via drill 0.5)
  Top(3v3+) 0.254: SWITCH_Q.GATE 67.31,91.61 v67.35,91.65
  Top(3v3+) 0.305: R43.2 64.69,90.87 SWITCH_Q.GATE
  Bottom(3v3GND) 0.254: v67.35,91.65 67.35,96.09 65.19,98.25 63.29,98.25 GATE.P$1
N$10
  Top(3v3+) 0.254: U$6.RIGHT 28.42,119.96 21.15,119.96 17.64,116.45 17.64,116.1
  Top(3v3+) 0.305: R3.1 19.44,114.31 17.64,116.1 | 28.53,120.01 U$6.RIGHT
  Top(3v3+) 0.406: U$6.RIGHT 28.73,119.48 33.06,115.14 33.06,112.94 U$2.LOWER_RIGHT
N$11
  Top(3v3+) 0.203: 18.23,82.86 KE_LED.C | KE_LED.C
  Top(3v3+) 0.305: R4.1 17.99,83.1 18.23,82.86
N$12
  Top(3v3+) 0.254: CHARGE_U.P$9 57.81,94.05 58.72,94.95 70.6,94.95 73.91,91.65 73.91,90.41 RVOUT.1
N$13
  Top(3v3+) 0.305: R5.1 17.41,96.38 17.94,95.85 18.17,95.85 18.2,95.83 18.2,94.77 CE_LED.C
N$14
  Top(3v3+) 0.254: R6.1 68.22,80.11 68.22,80.8 68.93,81.51 68.93,85.25 69.11,85.42 72.13,85.42 73.02,84.71 U$22.D
N$15
  Top(3v3+) 0.305: R9.2 15.51,83.13 15.07,82.69 15.07,81.86 KICK_LED.C
N$16
  Top(3v3+) 0.152: R30.2 138.34,85.42 U$15.12
N$17
  Top(3v3+) 0.305: R10.2 15.71,96.62 14.89,95.8 14.89,94.77 CHIP_LED.C
N$18
  Top(3v3+) 0.254: 17,115.74 17,116.7 20.91,120.6 22.53,120.6 23.21,121.19
  Top(3v3+) 0.305: R16.2 9.4,102.6 R13.1 11.33,101.42 12.74,100 17.54,100 19.44,101.9 R3.2 18.8,111.5 18.22,112.08 18.22,114.52 17,115.74 | 23.21,121.19 26.14,124.11 29.17,124.11 31.03,122.25 31.03,120.05 U$6.CENTER
N$19
  Top(3v3+) 0.305: DONE_LED.C 39.87,87.15 40.43,87.71 41.71,87.71 R12.1
N$20
  Top(3v3+) 0.305: R11.1 32.79,87.73 33.19,87.33 34.6,87.33 CHARGE_LED.C
N$21
  Top(3v3+) 0.305: R25.1 33.44,107.48 U$2.LOWER_LEFT
N$23
  Top(3v3+) 0.254: R21.2 122.42,112.9 122.72,112.6 122.72,110.76 PW_LED1.C
N$24
  Top(3v3+) 0.254: 56.71,91.11 56.81,91.01
  Top(3v3+) 0.305: 56.71,91.11 CHARGE_U.P$6
  Top(3v3+) 1.93: RSENSE.2 55.19,89.9 56.3,91.01 56.81,91.01 60.23,91.01 SWITCH_Q.SOURCE
N$29  (via drill 0.35)
  Top(3v3+) 0.152: U$5.4 13.46,111.56 v12.03,111.56 | v9.37,110.14 9.37,109.07 | 9.37,109.07 9.36,109.07 | 9.37,109.07 9.37,104.53 R16.1
  Top(3v3+) 0.305: R23.2 9.4,104.4 R16.1
  Bottom(3v3GND) 0.152: v12.03,111.56 10.79,111.56 v9.37,110.14
N$30
  Top(3v3+) 0.152: U$5.1 15.42,104.15 R26.2
N$32
  Top(3v3+) 0.305: BB_CON.4 94.88,19.41 R19.2
N$33
  Top(3v3+) 0.254: R6.2 69.95,79.91 70.7,79.91 70.68,79.89 KICK_READY.C
N$34
  Top(3v3+) 0.305: CHARGE_U.P$7 58.72,93.05 59.48,93.81 62.91,93.81 63.16,93.55 R43.1
N$35  (via drill 0.35)
  Bottom(3v3GND) 0.203: R8.2 105.71,108.89 v106.8,108.89 111.06,104.63 111.06,93.96 104.22,87.11 U$18.2
N$36  (via drill 0.7)
  Top(3v3+) 1.016: v25.39,115.85 25.39,111.14 U$2.TAB
  Bottom(3v3GND) 1.016: U$7.- 33.7,127.89 35.75,125.2 35.91,125.2 37.84,123.27 37.94,123.27 40.33,120.88 40.33,118.14 38.55,116.36 25.9,116.36 v25.39,115.85
N$38
  Bottom(3v3GND) 0.152: R32.1 63.18,44.72 62.41,45.49 58.72,45.49 58.36,45.14 58.36,44.63 58.72,44.28 60.49,44.28 U$8.7
  Bottom(3v3GND) 0.2: C13.2 61.29,42.21 U$8.8 U$8.7
N$40
  Top(3v3+) 0.203: R20.2 97.67,25.39 BB_CON.1
N$65
  Bottom(3v3GND) 0.203: U$18.3 97.17,85.84 R37.2
PWM0
  Bottom(3v3GND) 0.152: J1.3 55.44,29.95 62.32,29.95 U$14.10/CS
PWM1  (via drill 0.35)
  Top(3v3+) 0.152: U$14.2 47.83,34.6 48.79,33.63 49.59,33.63 50.26,34.3 50.26,34.57 50.34,34.57 51.33,35.56 52.13,35.56 52.7,35 52.7,34.8 53.86,33.63 54.67,33.63 55.24,34.2 55.24,36.1 60.75,41.62 60.75,50.4 67.68,57.33 v71.95,57.33
  Bottom(3v3GND) 0.152: v71.95,57.33 71.95,59.67 J3.7
PWM2  (via drill 0.35)
  Top(3v3+) 0.152: U$14.3/CANTX v49.19,43.82 | v49.19,45.8 49.19,45.93 48.23,46.9 48.23,50.32 49.6,51.69 J4.7
  Bottom(3v3GND) 0.152: v49.19,43.82 v49.19,45.8
PWM3
  Top(3v3+) 0.203: U$14.29 87.67,32.44 76.75,32.44 71.82,27.51 J2.3
RTS  (via drill 0.35)
  Top(3v3+) 0.152: R28.1 133.46,90.07 115.92,72.53 115.92,69.48 v99.15,52.71
  Bottom(3v3GND) 0.152: U$14.35/A16 95.24,52.71 v99.15,52.71
RX
  Top(3v3+) 0.152: U$15.2 114.8,97.89 114.8,70.78 94.91,50.9 U$14.34/A15
SCL
  Bottom(3v3GND) 0.2: U$8.3 54.45,44.81 54.18,44.54 R27.1
  Bottom(3v3GND) 0.203: U$8.3 57.65,44.81 57.9,45.06 57.9,48.62 56.81,49.71 U$14.19/A5/SCL
SCL-H  (via drill 0.35)
  Top(3v3+) 0.152: 114.76,46.8 U$21.12 113.79,46.61 111.26,46.61 106.09,41.43 v106.09,14.84 | U$17.12 23.67,43.53 22.9,43.53 22.16,42.8 v22.16,38.84 | v29.35,38.84 31.59,38.84 37.63,44.89 v58.97,44.89 | v72.66,29.42 70.7,31.37 v70.7,31.55
  Bottom(3v3GND) 0.152: v22.16,38.84 v29.35,38.84 | v72.66,29.42 78.91,23.17 78.91,18.97 82.15,15.73 105.2,15.73 v106.09,14.84 | v70.7,31.55 68.52,33.73 68.52,35.94 65.85,38.61 65.85,40.95 64.51,42.29 63.79,42.29 63.65,42.42 63.65,43.15 | 63.65,43.15 61.99,44.81 | 63.65,43.15 63.65,43.41 63.79,43.55 64.68,43.55 64.95,43.82 65.36,43.82 R33.1
  Bottom(3v3GND) 0.2: 61.99,44.81 61.46,44.81 U$8.6
  Bottom(3v3GND) 0.203: v58.97,44.89 59.05,44.81 61.46,44.81
SDA
  Bottom(3v3GND) 0.152: 59.35,50.91 U$14.18/A4/SDA
  Bottom(3v3GND) 0.2: U$8.4 50.92,46.08 50.44,45.6 R7.1
  Bottom(3v3GND) 0.203: U$8.4 55.59,46.49 55.59,50.93 56.3,51.64 58.61,51.64 59.35,50.91
SDA-H  (via drill 0.35)
  Top(3v3+) 0.152: 23.9,43.11 U$17.13 24.06,42.88 24.84,42.88 25.37,42.36 v25.37,39.91 | v30.17,39.91 32.23,39.91 37.51,45.19 58.03,45.19 v59.5,46.66 | v63.06,47.91 82.78,47.91 84.35,46.33 85.55,46.33 87.55,44.33 87.55,42.69 87.9,42.34 88.96,42.34 100.97,42.34 101.48,42.86 101.48,44.02 v101.82,44.35 | v110.35,44.17 112.33,46.15 U$21.13
  Bottom(3v3GND) 0.152: v25.37,39.91 v30.17,39.91 | v59.5,46.66 60.65,46.66 U$8.5 | v101.82,44.35 110.18,44.35 v110.35,44.17
  Bottom(3v3GND) 0.2: R34.1 68.04,45.6 67.5,46.13
  Bottom(3v3GND) 0.203: 67.5,46.13 63.24,46.13 | 63.24,46.13 61.28,46.13 U$8.5 | 63.24,46.13 63.24,47.73 v63.06,47.91
TO_DRIB
  Bottom(3v3GND) 0.813: 5.63,87.13 5.07,86.56 | DRIB_TRAN.DRAIN 16.6,87.13
  Bottom(3v3GND) 1.27: 5.07,86.56 DRIB.2 | 16.6,87.13 5.63,87.13
TO_NEON
  Bottom(3v3GND) 0.254: 74.34,99.66 NEON.1
  Bottom(3v3GND) 0.61: 74.34,99.66 R24.1
TRANS_OUT  (via drill 1.3 pad 2.79)
  Top(3v3+) 2.184: v91.99,108.03 91.99,106.76 96.56,102.19 96.56,97.87 96.44,97.74 96.44,98.37 U$3.P$1
  Bottom(3v3GND) 2.184: CHARGE_D.A 91.88,108.14 v91.99,108.03
TX
  Top(3v3+) 0.152: U$15.3 115.33,96.42 115.33,70.13 97.45,52.25 U$14.33/A14
UNBUF_DIVCAP
  Bottom(3v3GND) 0.305: CLAMP2.C 99.88,118.85 R15.2 102.98,121.7 R14.1 103.01,120.76 103.42,120.35 103.42,118.84 CLAMP1.A 104.71,118.81 105.33,118.19 105.33,112.22 104.69,111.59 CAP_SENSE_BUF.3

## Text on the board
Dimension: Dimensions in mm
Document: MOTHERBOARD